# EAGLE design 612_jetracer_328_020024 (EAGLE 9.6.2)
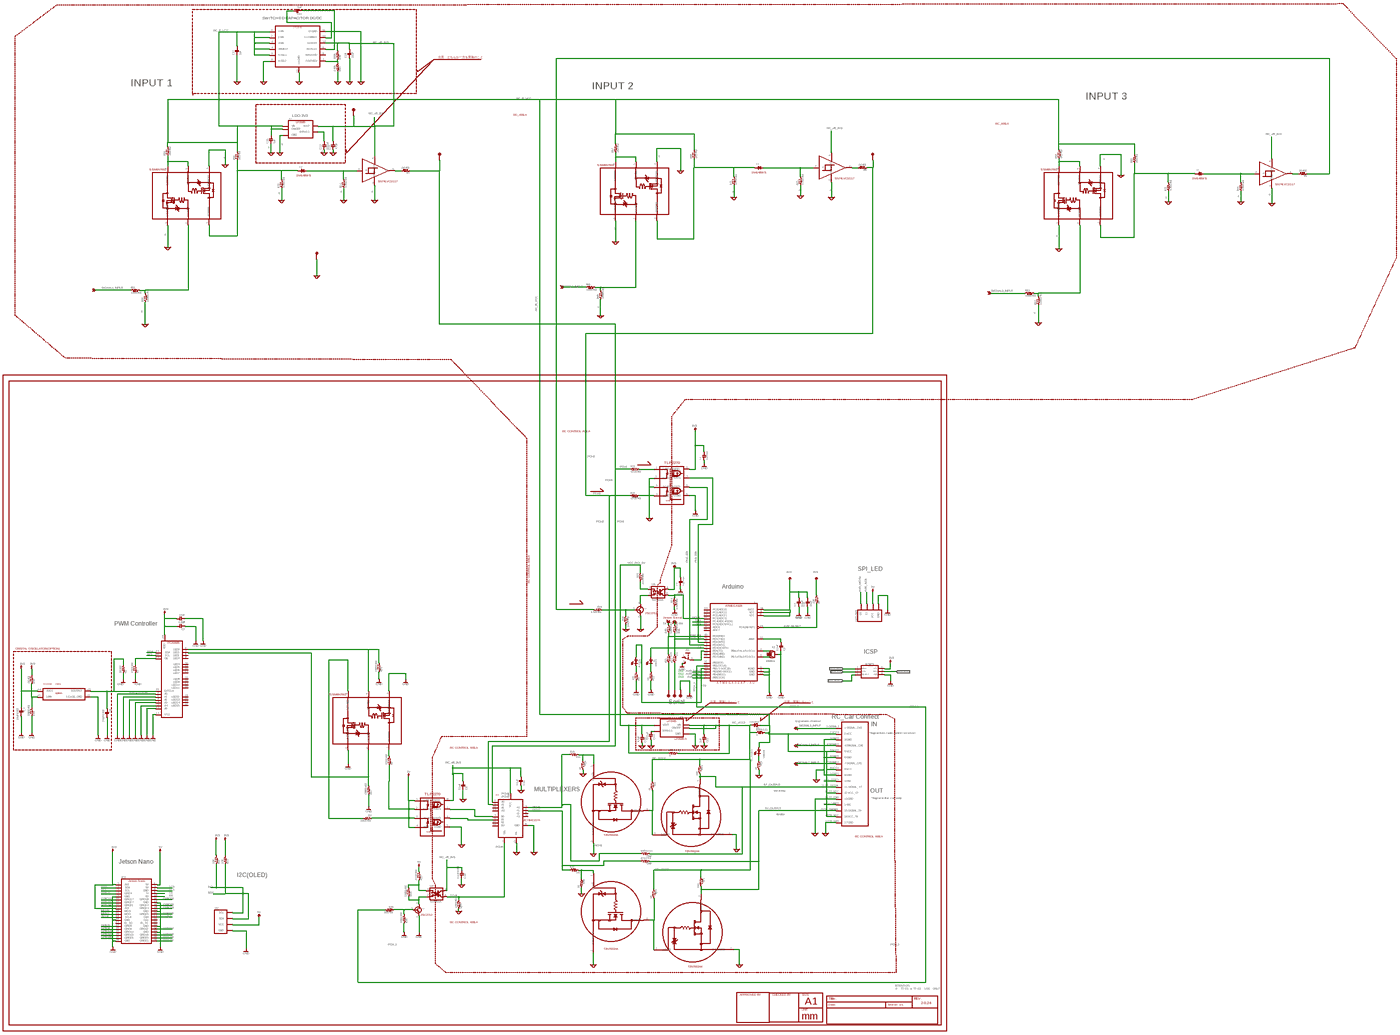
[diagram p0: schematic, sheet 1, overview]
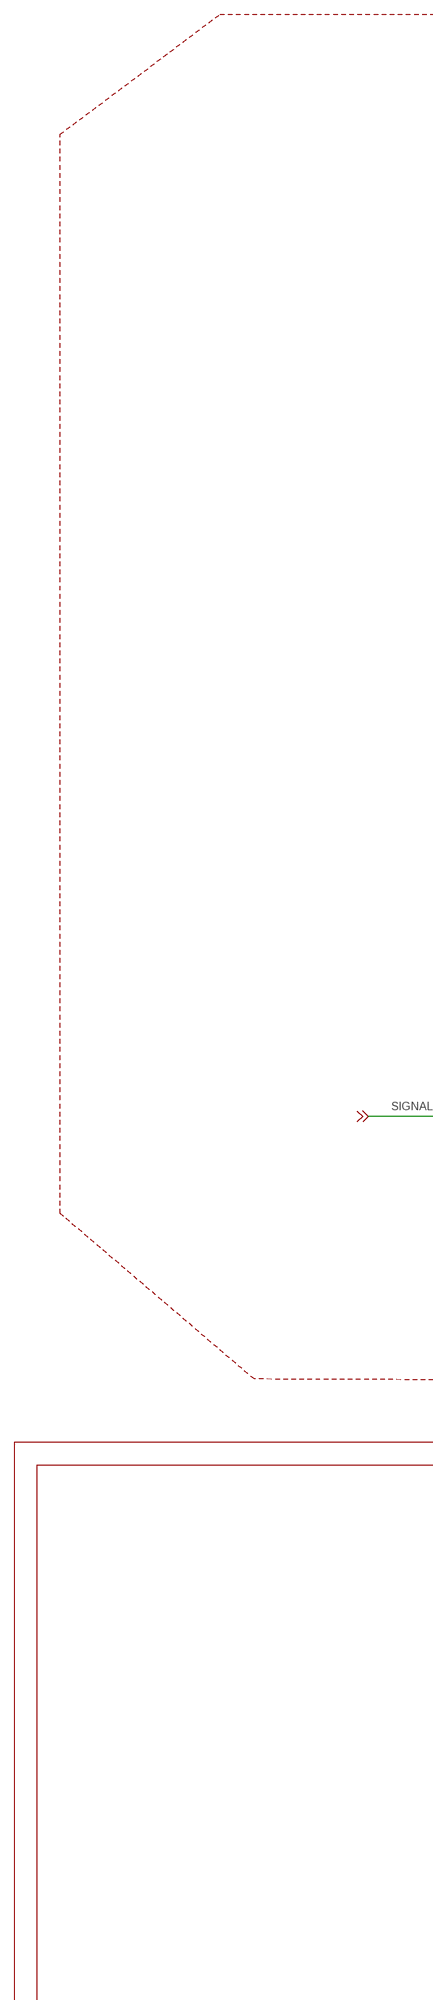
[diagram p1: schematic, sheet 1, part 1 of 7]
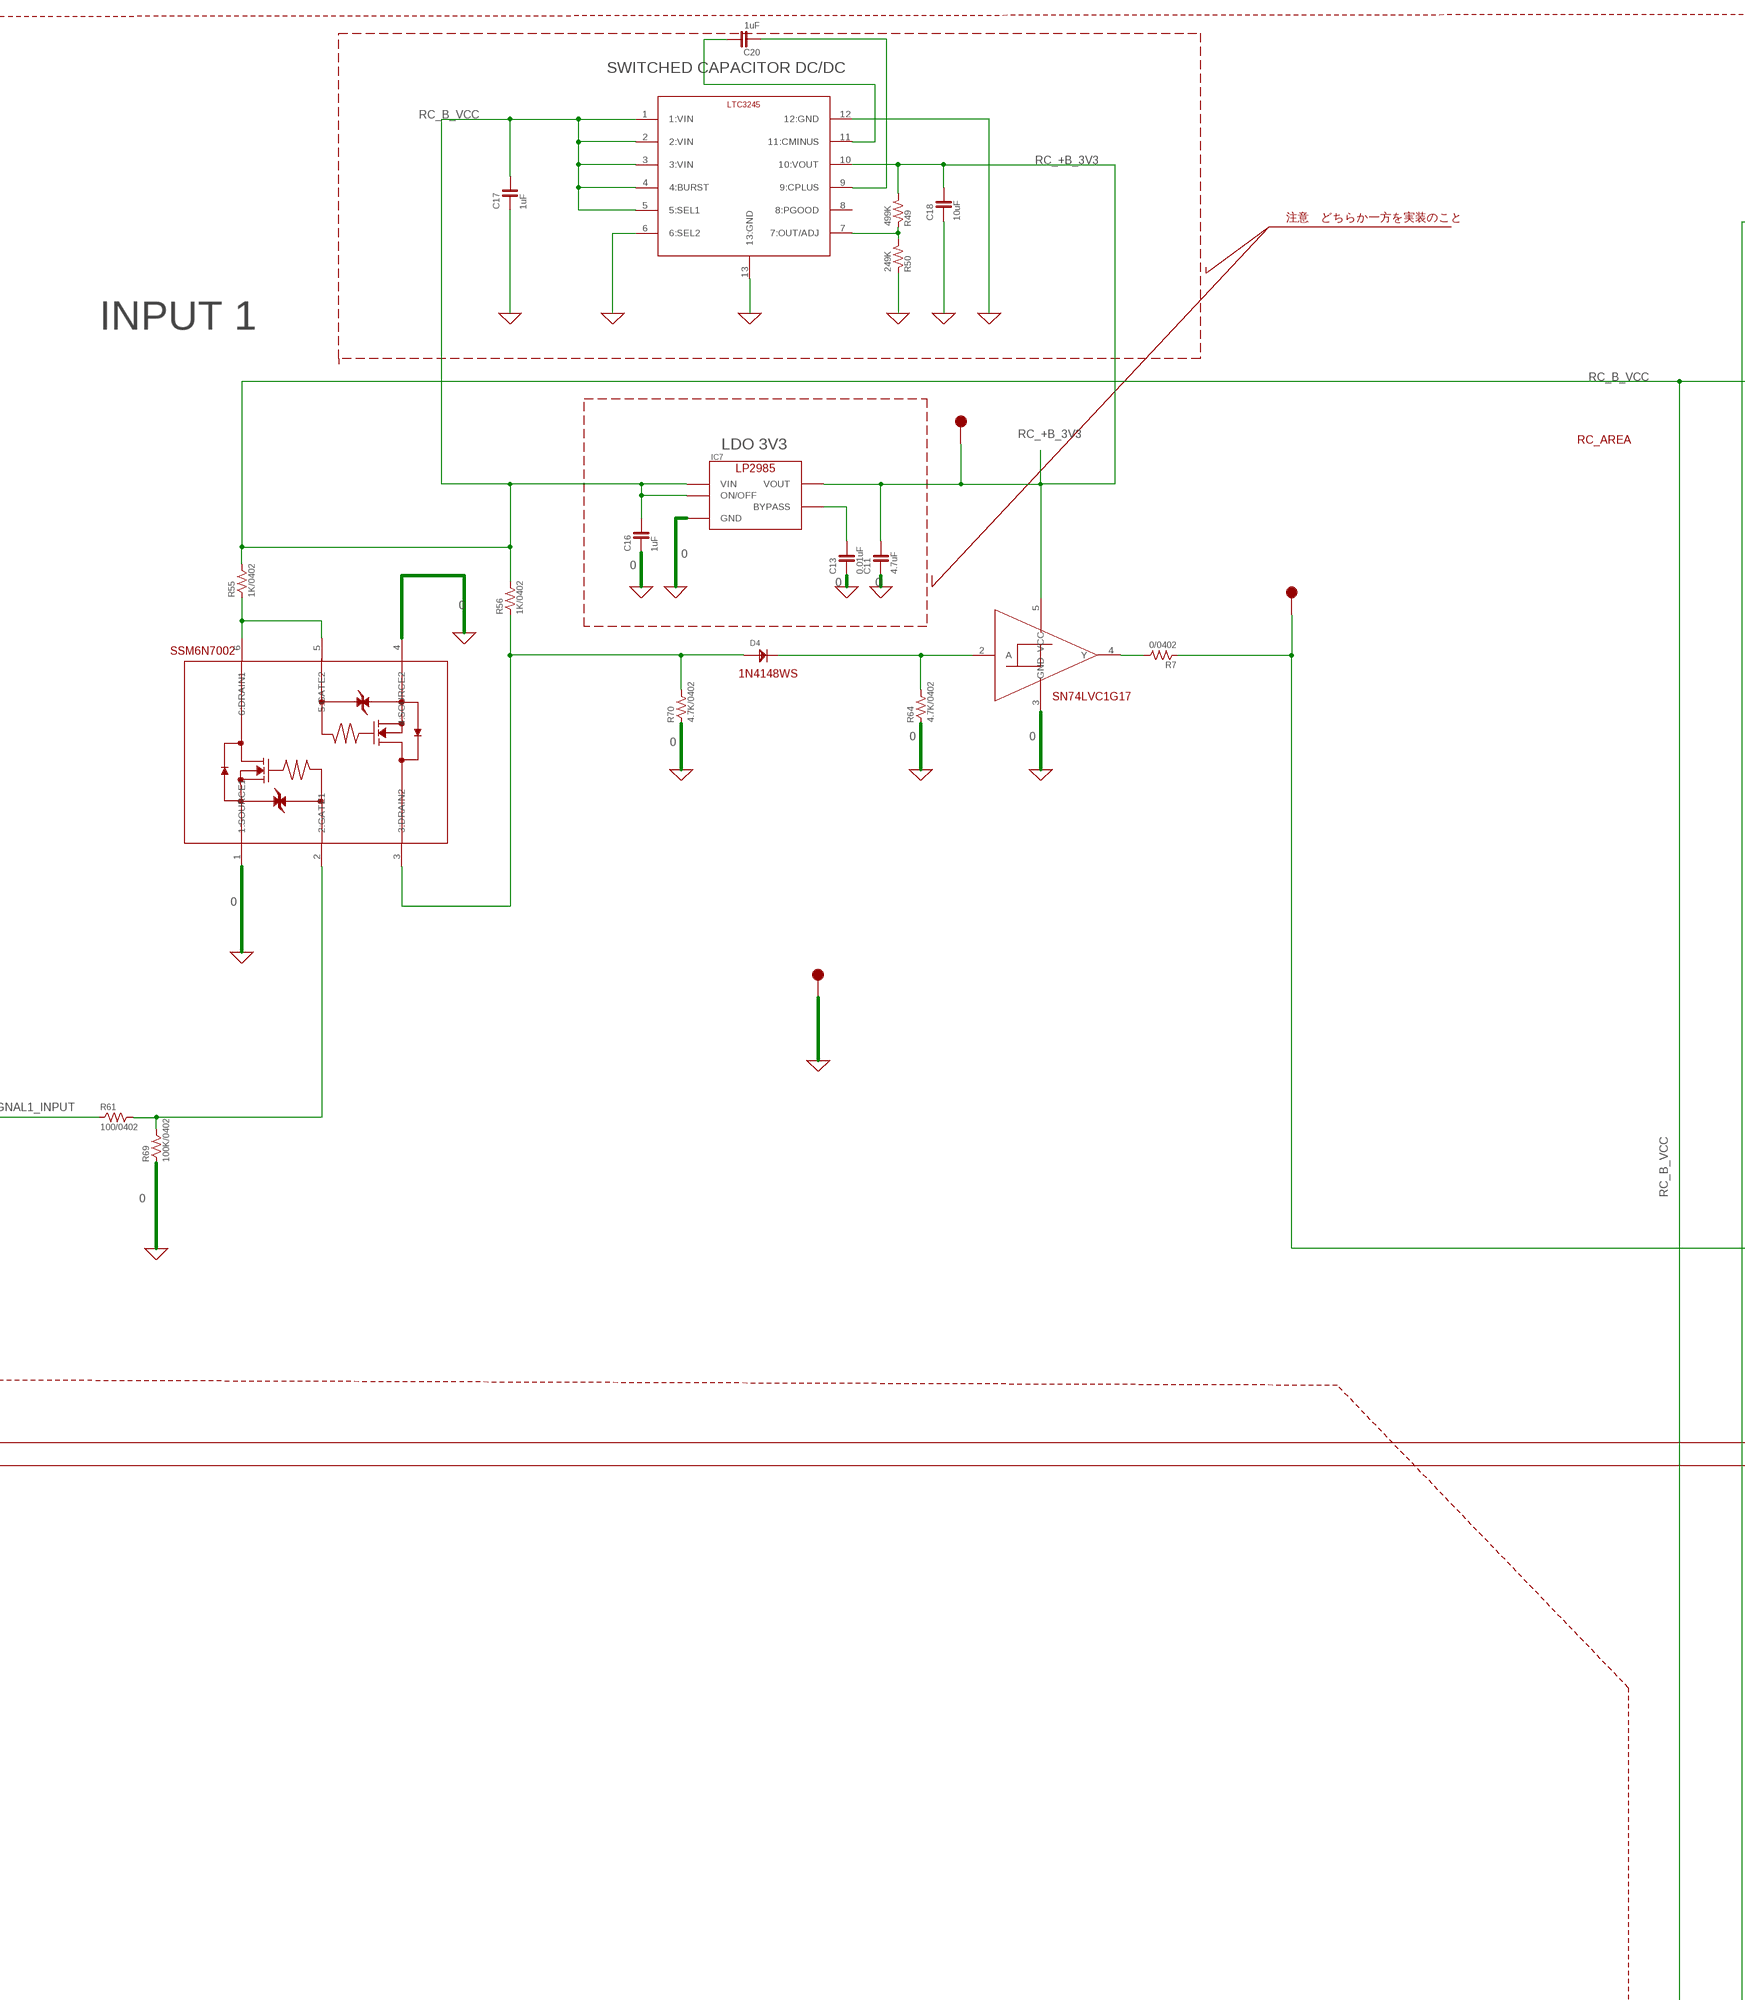
[diagram p2: schematic, sheet 1, part 2 of 7]
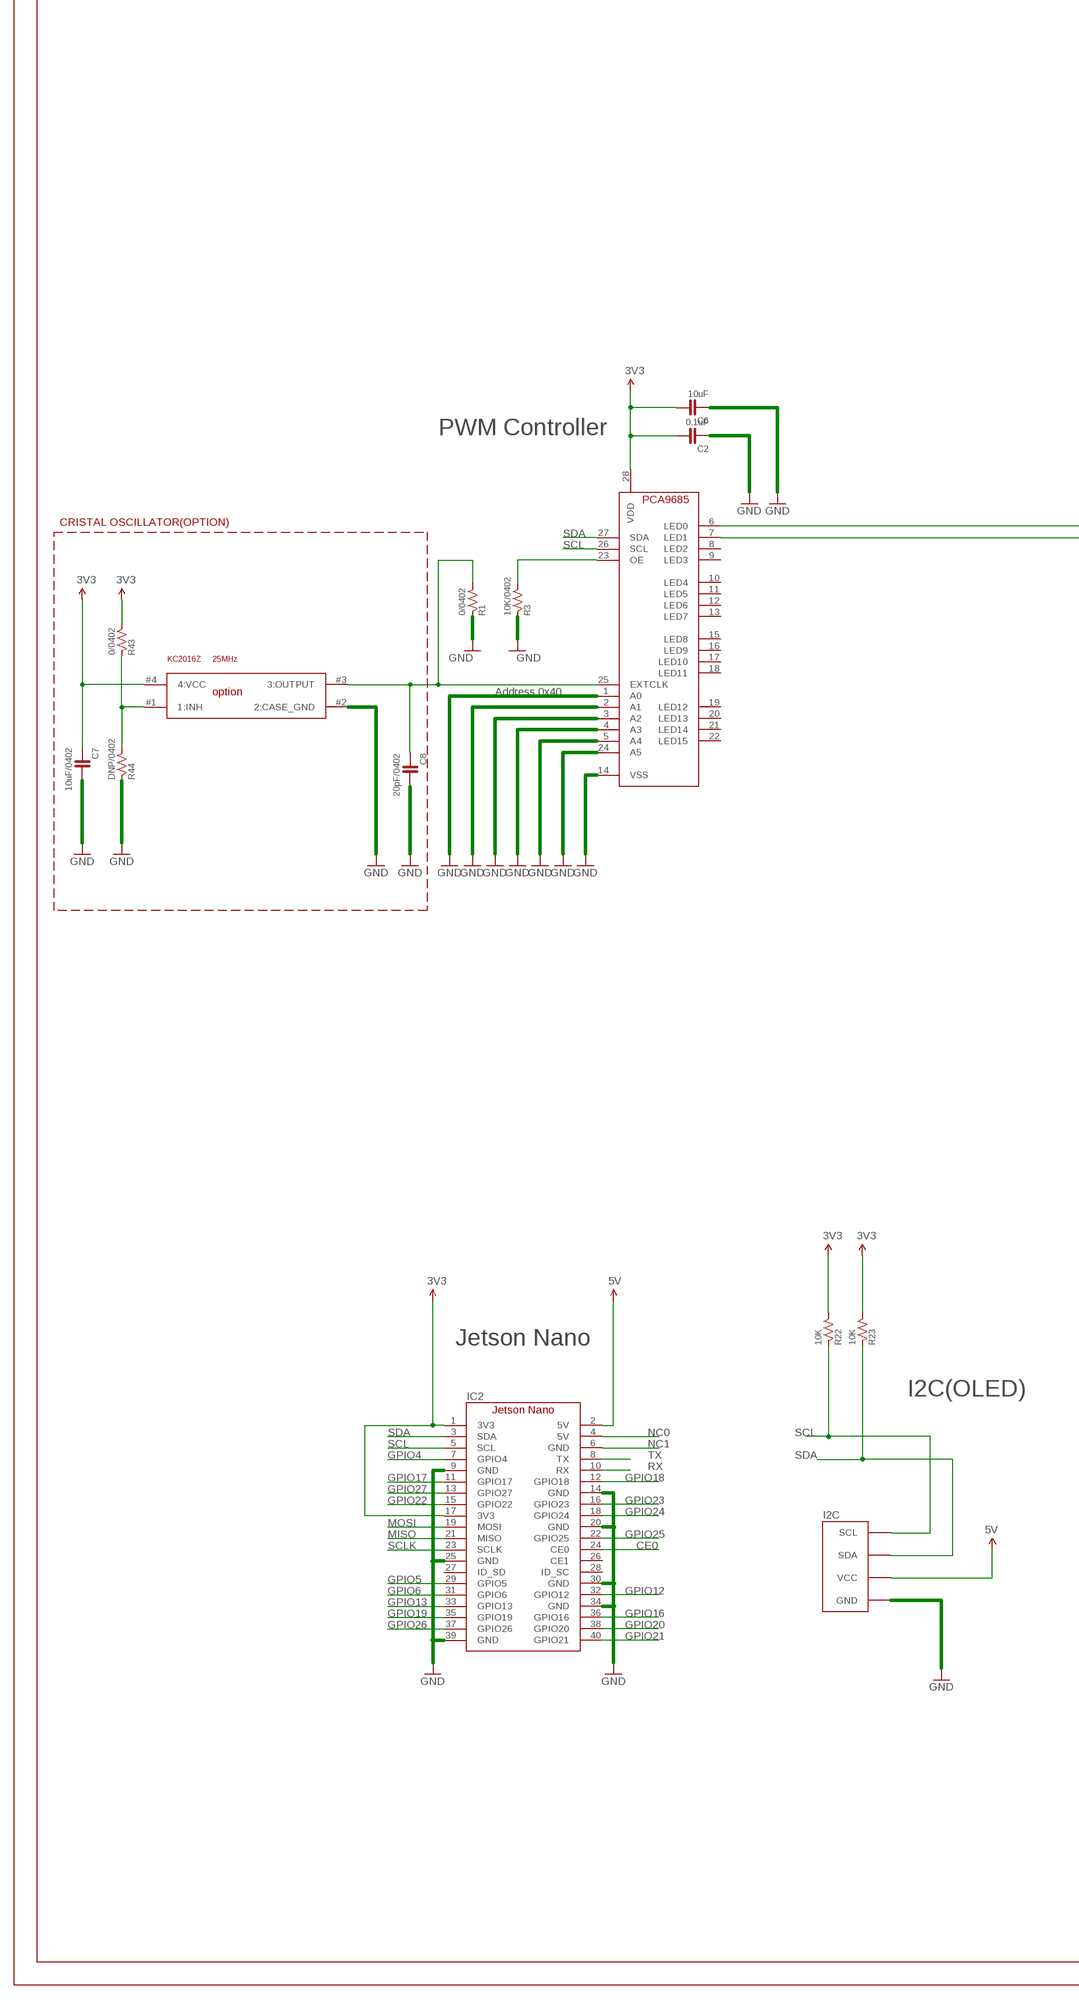
[diagram p3: schematic, sheet 1, part 3 of 7]
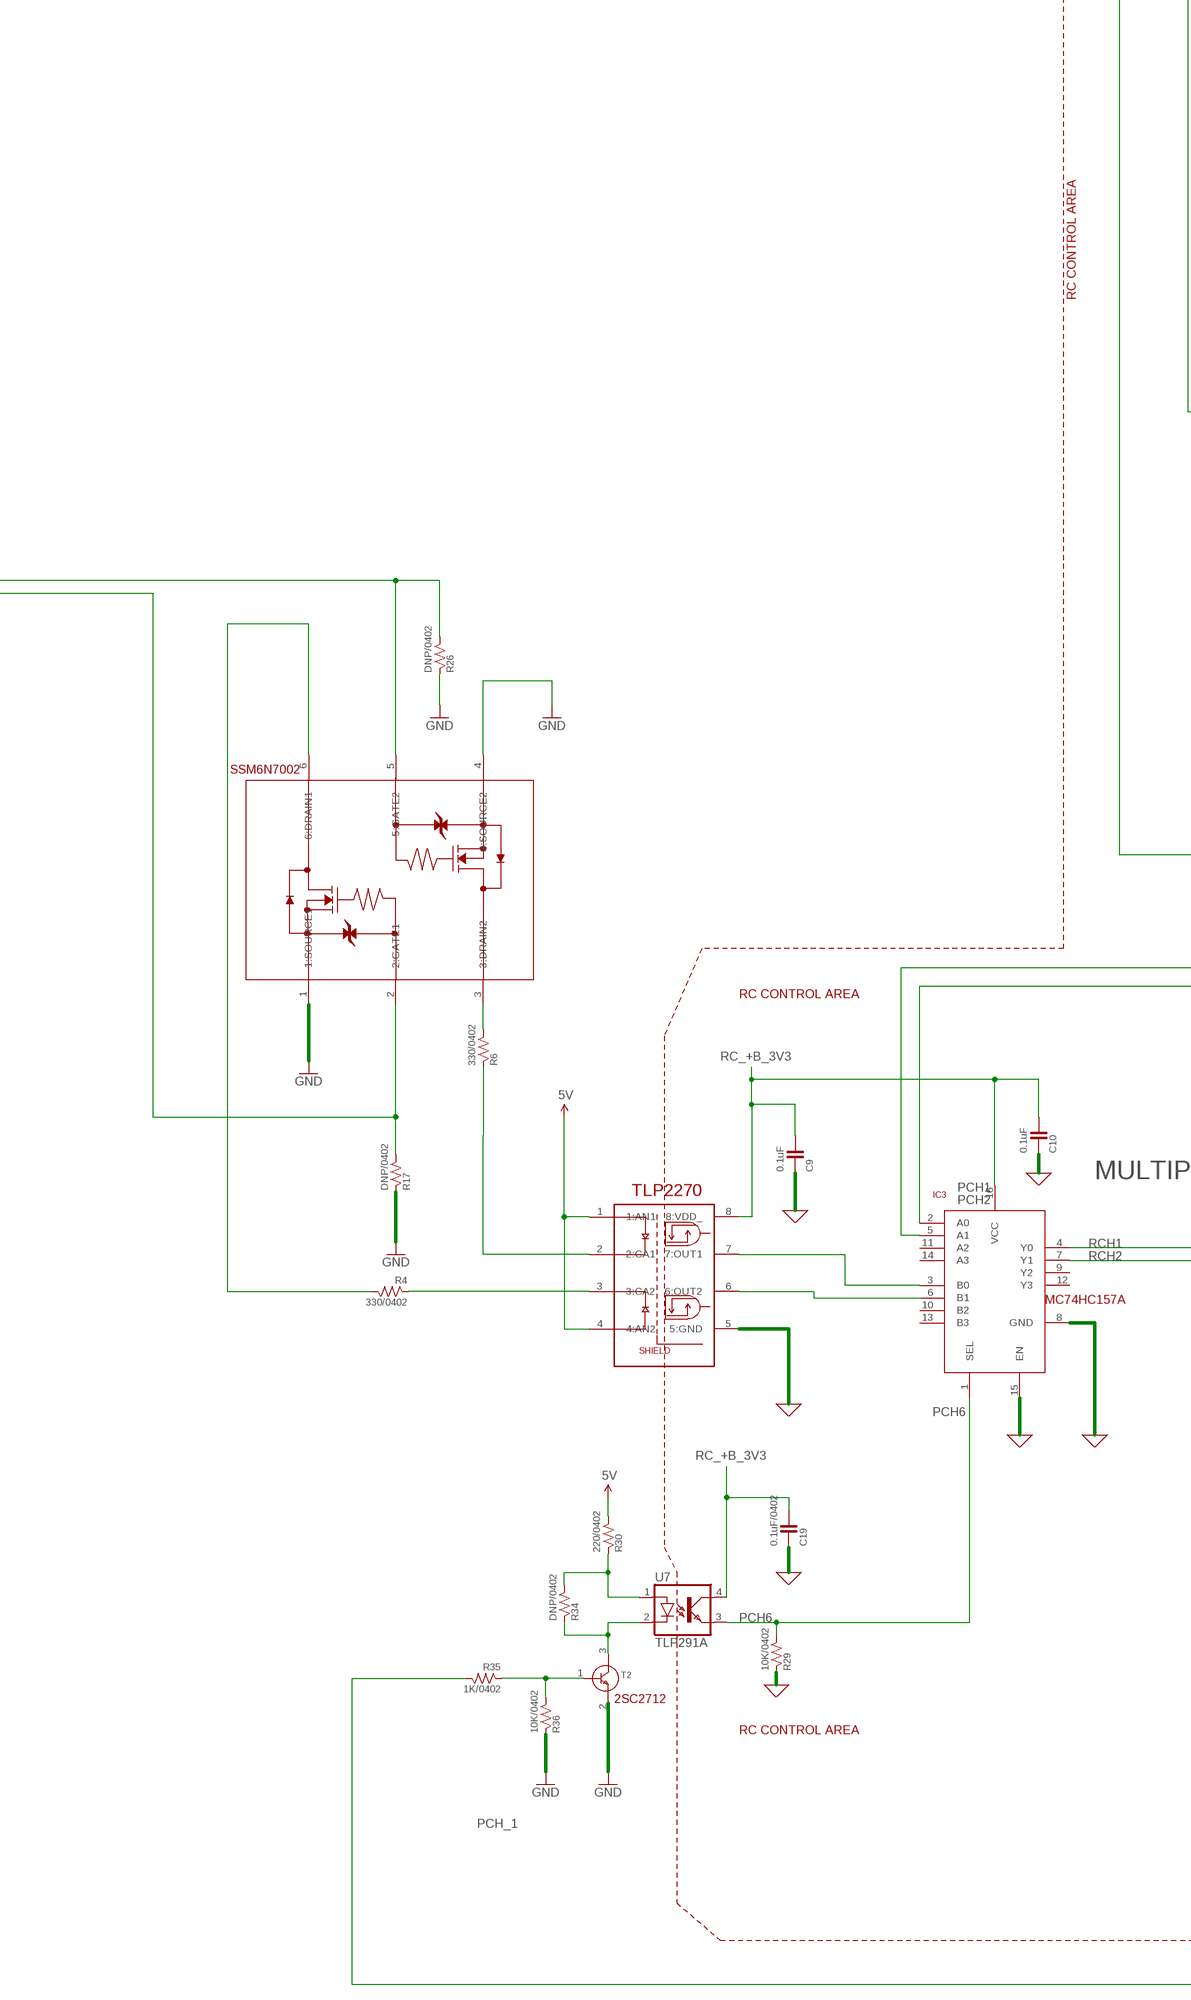
[diagram p4: schematic, sheet 1, part 4 of 7]
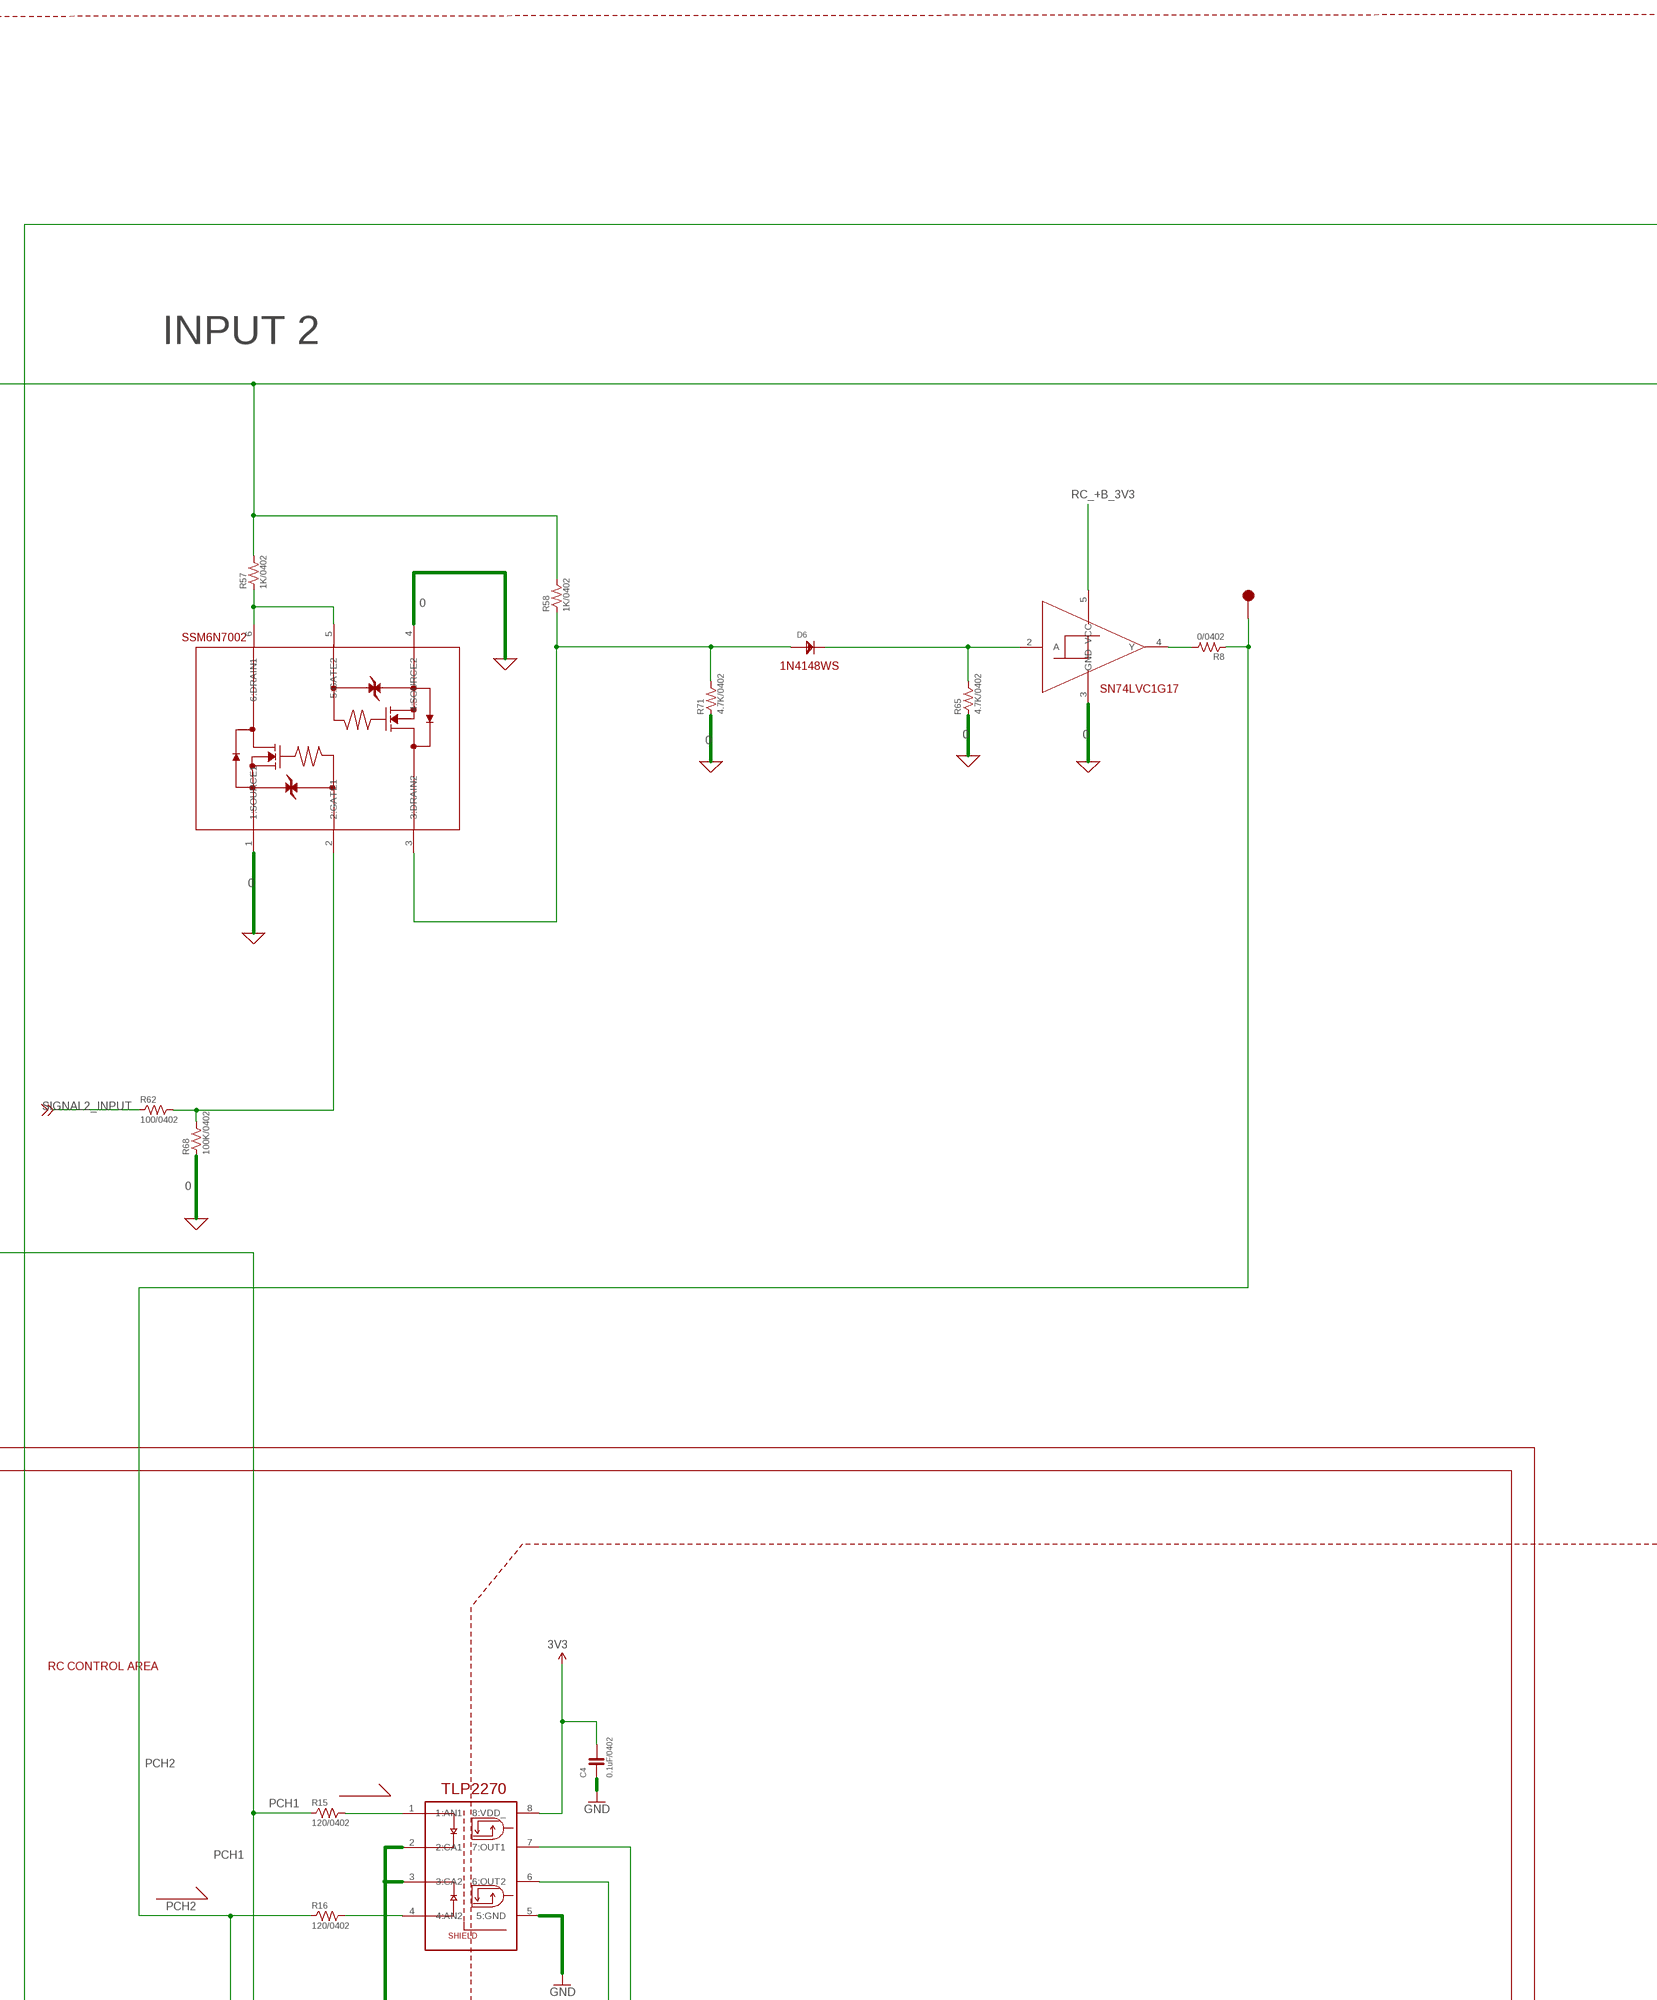
[diagram p5: schematic, sheet 1, part 5 of 7]
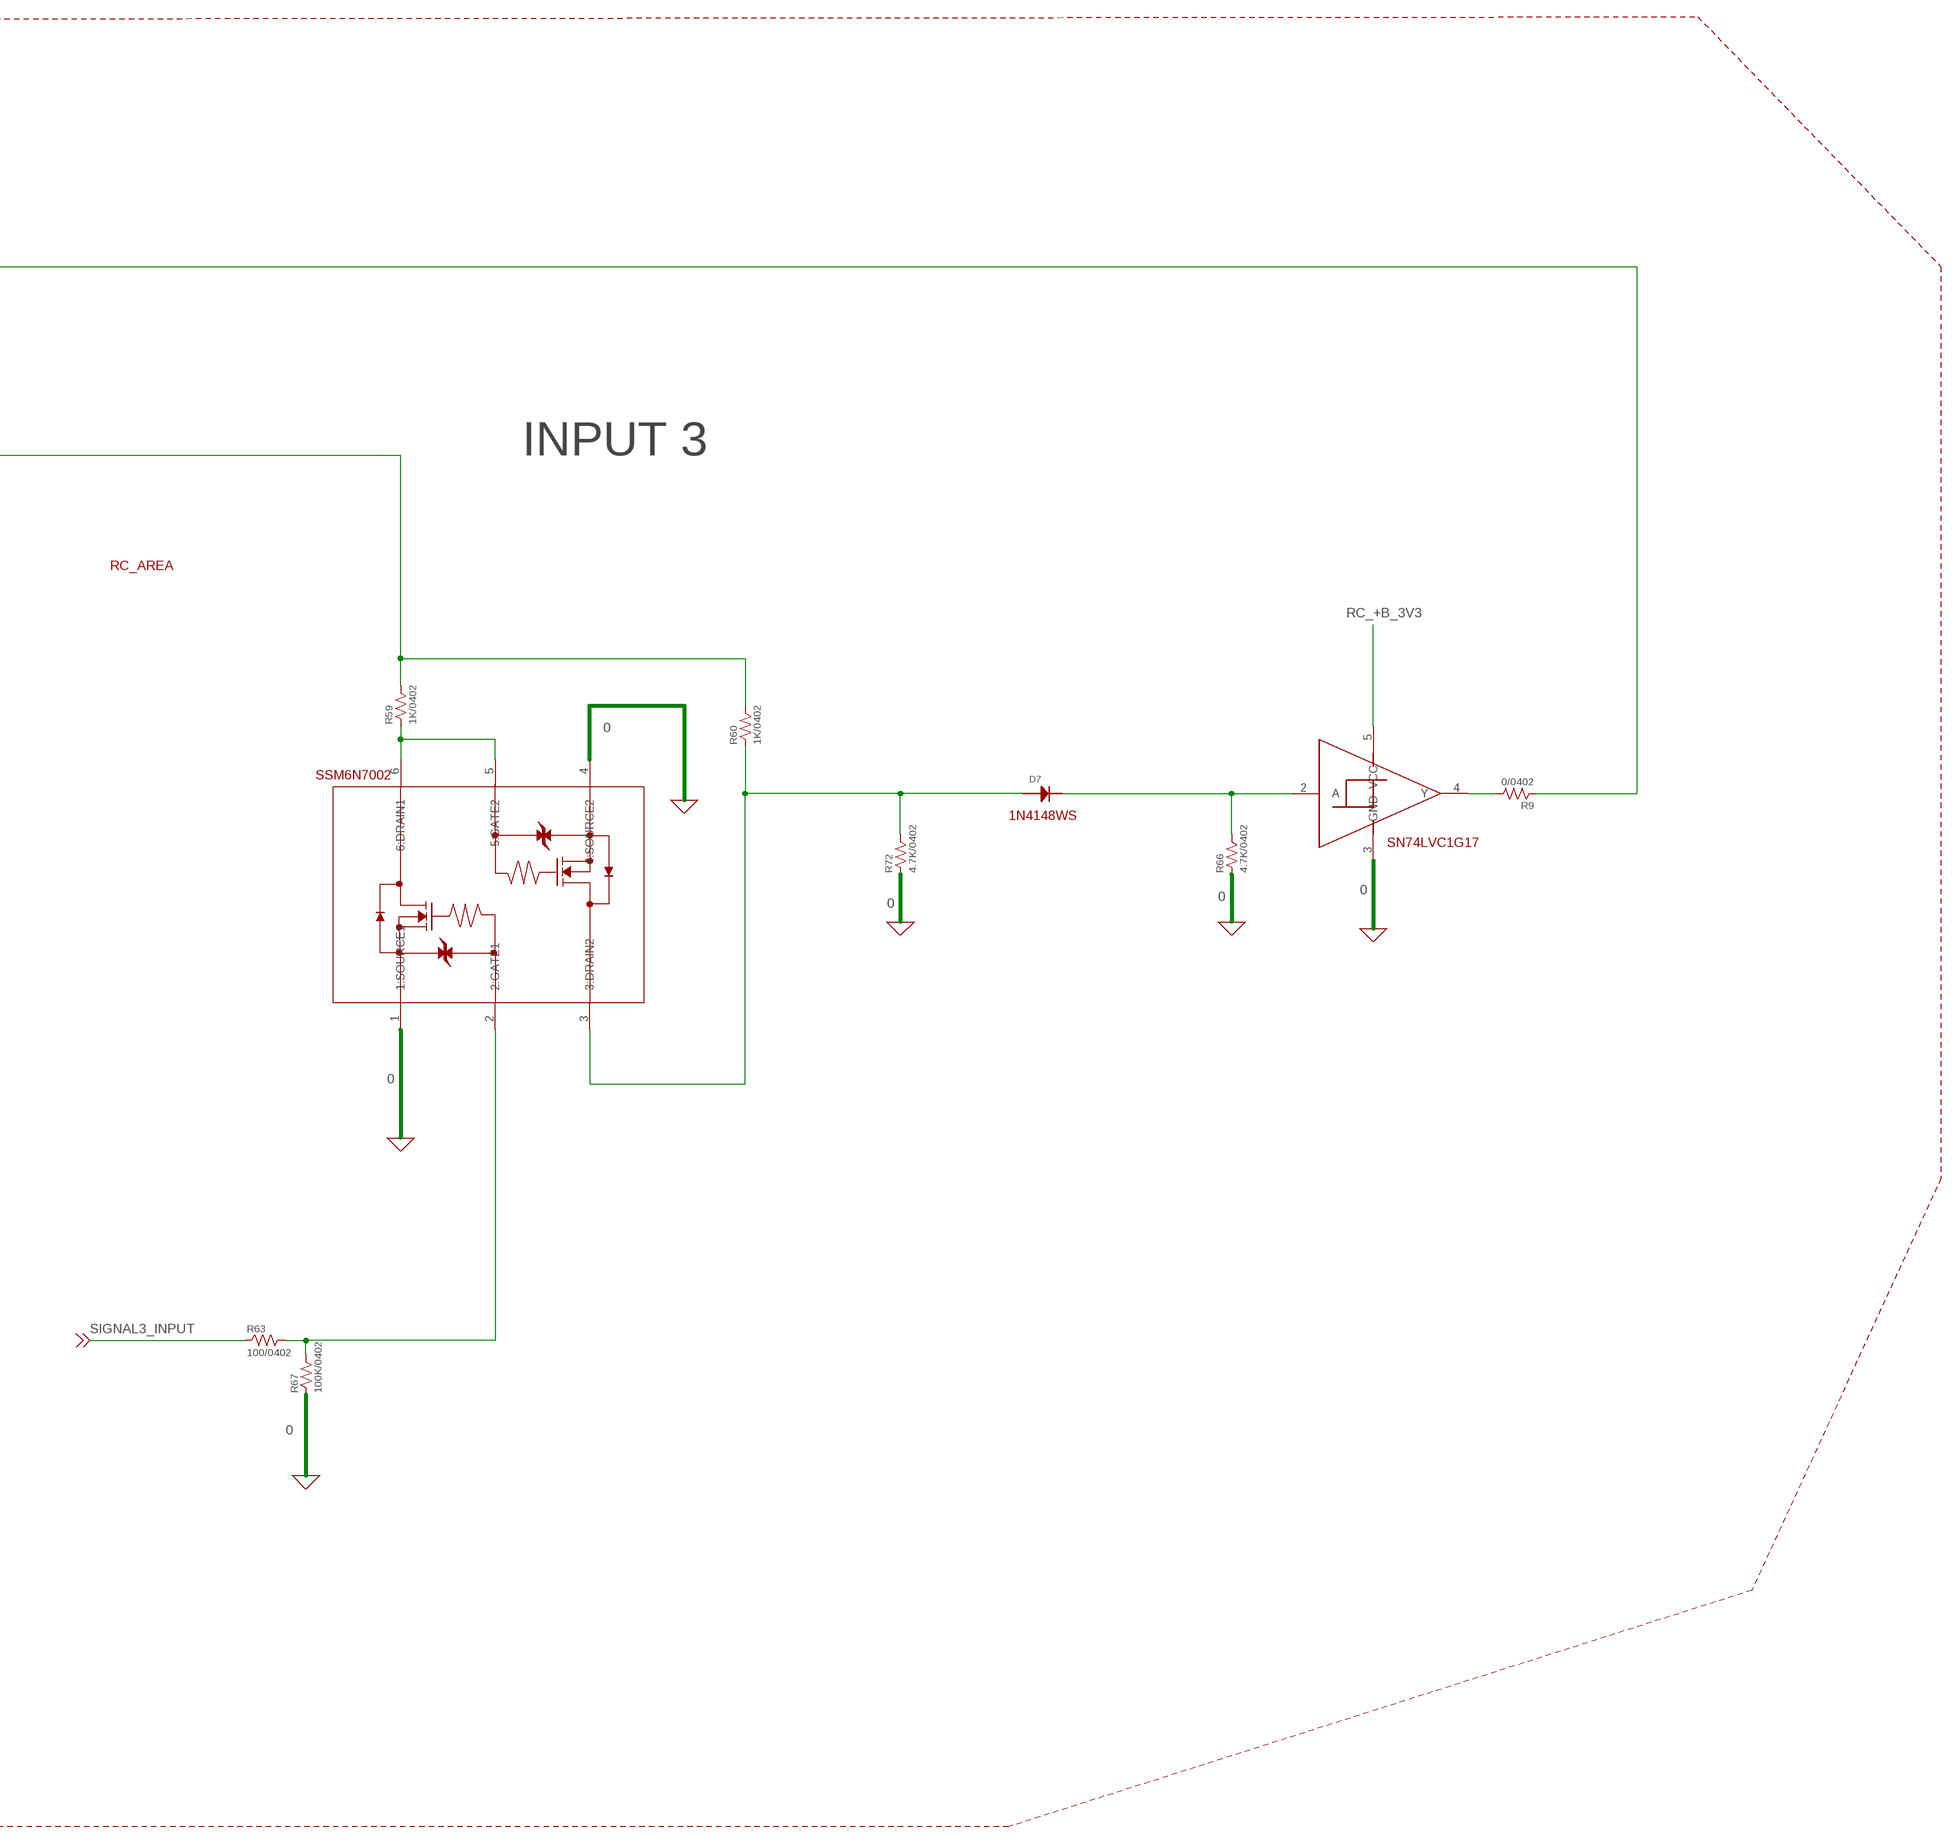
[diagram p6: schematic, sheet 1, part 6 of 7]
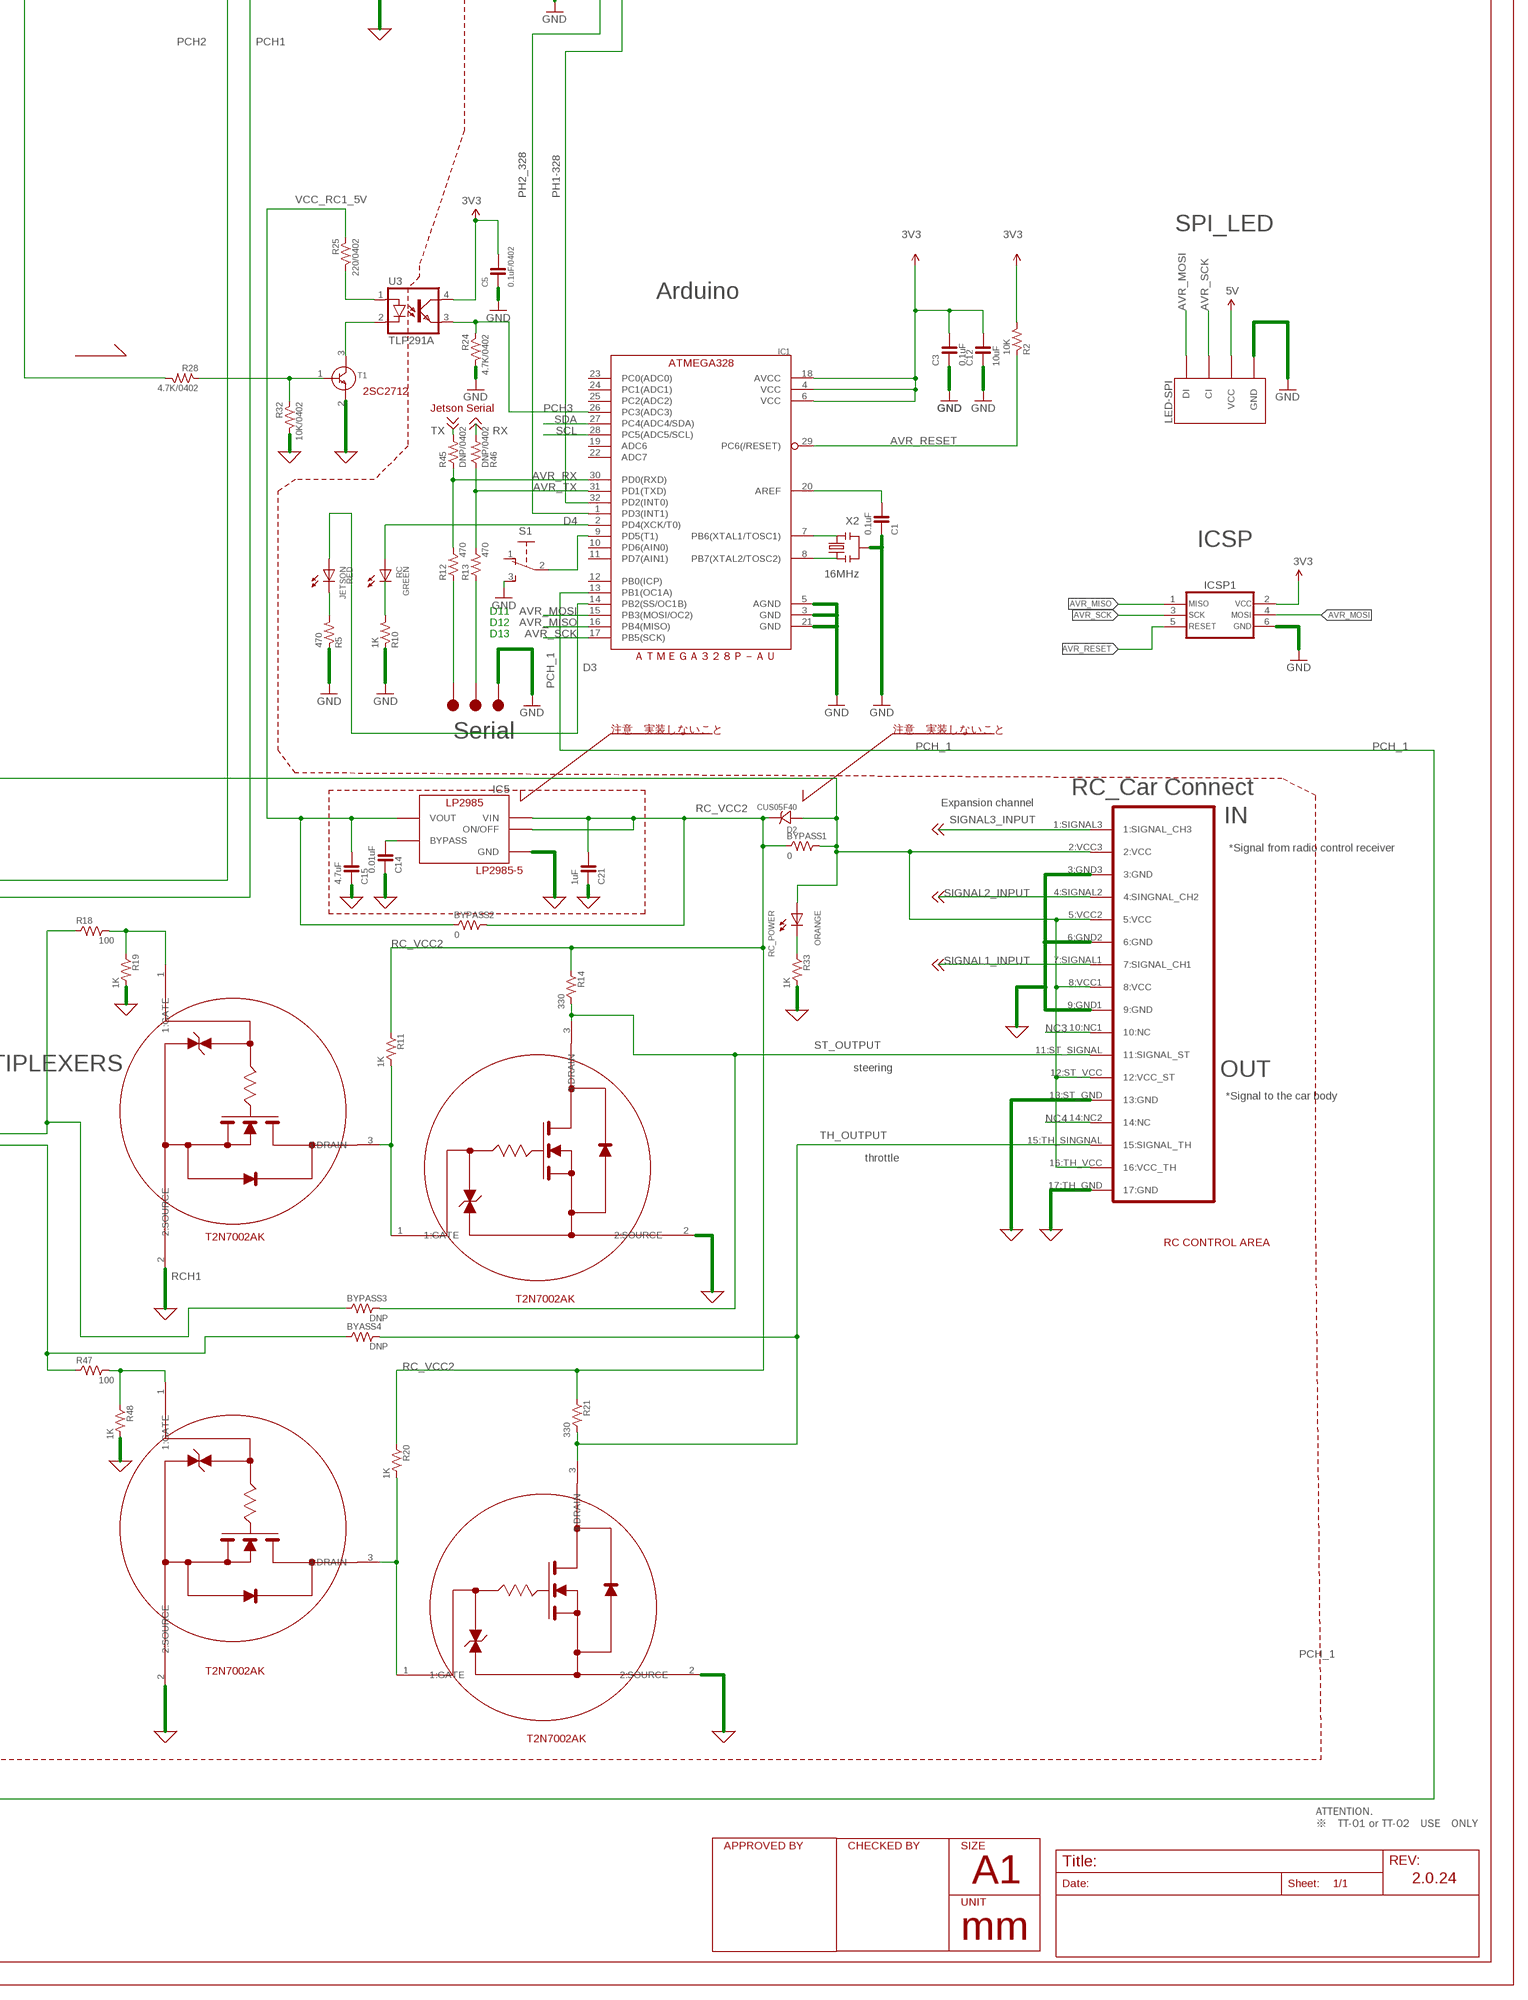
[diagram p7: schematic, sheet 1, part 7 of 7]

## Parts
BYASS4  DNP  RESISTOR-0603  [0603]
BYPASS1  0  RESISTOR-0805  [0805]
BYPASS2  0  RESISTOR-0805  [0805]
BYPASS3  DNP  RESISTOR-0603  [0603]
C1  0.1uF  CAPACITOR-0603  [0603]
C2  0.1uF  CAPACITOR-0603  [0603]
C3  0.1uF  CAPACITOR-0402  [0402]
C4  0.1uF/0402  CAPACITOR-0402  [0402]
C5  0.1uF/0402  CAPACITOR-0402  [0402]
C6  10uF  CAPACITOR-0603  [0603]
C7  10uF/0402  CAPACITOR-0402  [0402]
C8  20pF/0402  CAPACITOR-0402  [0402]
C9  0.1uF  CAPACITOR-0603  [0603]
C10  0.1uF  CAPACITOR-0603  [0603]
C11  4.7uF  CAPACITOR-0603  [0603]
C12  10uF  CAPACITOR-0402  [0402]
C13  0.01uF  CAPACITOR-0603  [0603]
C14  0.01uF  CAPACITOR-0603  [0603]
C15  4.7uF  CAPACITOR-0603  [0603]
C16  1uF  CAPACITOR-0603  [0603]
C17  1uF  CAPACITOR-0603  [0603]
C18  10uF  CAPACITOR-0603  [0603]
C19  0.1uF/0402  CAPACITOR-0402  [0402]
C20  1uF  CAPACITOR-0603  [0603]
C21  1uF  CAPACITOR-0603  [0603]
D2  CUS05F40  [CUS05F40]
D4  DIODE-SOD-323  [SOD-323]
D6  DIODE-SOD-323  [SOD-323]
D7  DIODE-SOD-323  [SOD-323]
I2C  FABO-I2C_BM04B  [I2C-BM04B-PASS-1]
IC1  ATMEGA328P-AU  [TQFP-32]
IC2  JETSON_NANO_NOBORDER  [JETSON_NANO_NOBOARDER]
IC3  MULTIPLEXERSMC74HC157A  [TSSOP-16]
IC4  PCA9685_BOTTOM  [PCA9685_BOTTOM]
IC5  LP2985-33DBV  [SOT-23-5]
IC7  LP2985-33DBV  [SOT-23-5]
ICSP1  ICSP_AVR-TC_NOHOLE  [TC2030]
JETSON  GREEN  LED-0603  [0603]
LED-SPI  FABO-SPI-LED-BM04B  [SPI-BM04B-PASS-1]
R1  0/0402  RESISTOR-0402  [0402]
R2  10K  RESISTOR-0603  [0603]
R3  10K/0402  RESISTOR-0402  [0402]
R4  330/0402  RESISTOR-0402  [0402]
R5  470  RESISTOR-0603  [0603]
R6  330/0402  RESISTOR-0402  [0402]
R7  0/0402  RESISTOR-0402  [0402]
R8  0/0402  RESISTOR-0402  [0402]
R9  0/0402  RESISTOR-0402  [0402]
R10  1K  RESISTOR-0603  [0603]
R11  1K  RESISTOR-0603  [0603]
R12  470  RESISTOR-0603  [0603]
R13  470  RESISTOR-0603  [0603]
R14  330  RESISTOR-0603  [0603]
R15  120/0402  RESISTOR-0402  [0402]
R16  120/0402  RESISTOR-0402  [0402]
R17  DNP/0402  RESISTOR-0402  [0402]
R18  100  RESISTOR-0603  [0603]
R19  1K  RESISTOR-0603  [0603]
R20  1K  RESISTOR-0603  [0603]
R21  330  RESISTOR-0603  [0603]
R22  10K  RESISTOR-0603  [0603]
R23  10K  RESISTOR-0603  [0603]
R24  4.7K/0402  RESISTOR-0402  [0402]
R25  220/0402  RESISTOR-0402  [0402]
R26  DNP/0402  RESISTOR-0402  [0402]
R28  4.7K/0402  RESISTOR-0402  [0402]
R29  10K/0402  RESISTOR-0402  [0402]
R30  220/0402  RESISTOR-0402  [0402]
R32  10K/0402  RESISTOR-0402  [0402]
R33  1K  RESISTOR-0603  [0603]
R34  DNP/0402  RESISTOR-0402  [0402]
R35  1K/0402  RESISTOR-0402  [0402]
R36  10K/0402  RESISTOR-0402  [0402]
R43  0/0402  RESISTOR-0402  [0402]
R44  DNP/0402  RESISTOR-0402  [0402]
R45  DNP/0402  RESISTOR-0402  [0402]
R46  DNP/0402  RESISTOR-0402  [0402]
R47  100  RESISTOR-0603  [0603]
R48  1K  RESISTOR-0603  [0603]
R49  499K  RESISTOR-0603  [0603]
R50  249K  RESISTOR-0603  [0603]
R55  1K/0402  RESISTOR-0402  [0402]
R56  1K/0402  RESISTOR-0402  [0402]
R57  1K/0402  RESISTOR-0402  [0402]
R58  1K/0402  RESISTOR-0402  [0402]
R59  1K/0402  RESISTOR-0402  [0402]
R60  1K/0402  RESISTOR-0402  [0402]
R61  100/0402  RESISTOR-0402  [0402]
R62  100/0402  RESISTOR-0402  [0402]
R63  100/0402  RESISTOR-0402  [0402]
R64  4.7K/0402  RESISTOR-0402  [0402]
R65  4.7K/0402  RESISTOR-0402  [0402]
R66  4.7K/0402  RESISTOR-0402  [0402]
R67  100K/0402  RESISTOR-0402  [0402]
R68  100K/0402  RESISTOR-0402  [0402]
R69  100K/0402  RESISTOR-0402  [0402]
R70  4.7K/0402  RESISTOR-0402  [0402]
R71  4.7K/0402  RESISTOR-0402  [0402]
R72  4.7K/0402  RESISTOR-0402  [0402]
RC  RED  LED-0603  [0603]
RC_POWER  ORANGE  LED-0603  [0603]
S1  SLIDE-SSSS810701  [SSSS810701]
T1  TRANSISTOR-NPN  [SOT-23]
T2  TRANSISTOR-NPN  [SOT-23]
T3  T2N7002AK  [SOT-23]
T4  T2N7002AK  [SOT-23]
T10  T2N7002AK  [SOT-23]
T11  T2N7002AK  [SOT-23]
TP1  TP-15  [TP-15]
TP2  TP-15  [TP-15]
TP3  TP-15  [TP-15]
TP4  TP-15  [TP-15]
TP5  TP-15  [TP-15]
TP6  TP-15  [TP-15]
TP7  TP-15  [TP-15]
U3  TLP291A  [11-3C1]
U5  TLP2270  [TLP2270]
U7  TLP291A  [11-3C1]
U12  SSM6N7002KFU  [US6]
U20  SN74LVC1G17  [SOT-23]
U21  SSM6N7002KFU  [US6]
U23  SN74LVC1G17  [SOT-23]
U$1  RC_17PIN_OUTIN  [PNHEADER_2.54_SMT_17PIN_RC_TT01_02]
U$6  SSM6N7002KFU  [US6]
U$7  SN74LVC1G17  [SOT-23]
U$8  TLP2270  [TLP2270]
U$10  SSM6N7002KFU  [US6]
U$11  KC2016Z  [KC2016Z]
U$15  LTC3245  [MSOP12]
X2  16MHz  RESONATOR  [CSTNE_V_C]

## Nets
0: C9.1 C10.1 C11.1 C13.1 C14.1 C15.1 C16.1 C17.1 C18.1 C19.1 C21.1 IC3.8(GND) IC3.15(EN) IC5.2(GND) IC7.2(GND) R19.2 R29.1 R32.2 R33.2 R48.2 R50.1 R64.1 R65.1 R66.1 R67.1 R68.1 R69.1 R70.1 R71.1 R72.1 T1.2(E) T3.2(2:SOURCE) T4.2(2:SOURCE) T10.2(2:SOURCE) T11.2(2:SOURCE) TP7.1 U5.2(2:CA1) U5.3(3:CA2) U12.1(1:SOURCE1) U12.4(4:SOURCE2) U20.3(GND) U21.1(1:SOURCE1) U21.4(4:SOURCE2) U23.3(GND) U$1.3:GND3(3:GND) U$1.6:GND2(6:GND) U$1.9:GND1(9:GND) U$1.13:ST_GND(13:GND) U$1.17:TH_GND(17:GND) U$7.3(GND) U$8.5(5:GND) U$10.1(1:SOURCE1) U$10.4(4:SOURCE2) U$15.6(6:SEL2) U$15.12(12:GND) U$15.13(13:GND) ; supply symbol labelled GND
3V3: C2.2 C3.2 C4.2 C5.2 C6.2 C7.1 C12.2 IC1.4(VCC) IC1.6(VCC) IC1.18(AVCC) IC2.1(3V3) IC2.17(3V3) IC4.28(VDD) ICSP1.2 R2.2 R22.2 R23.2 R43.2 U3.4(COL) U5.8(8:VDD_) U$11.#4(4:VCC)
5V: I2C.5V(VCC) IC2.2(5V) LED-SPI.5V(VCC) R30.2 U$8.1(1:AN1) U$8.4(4:AN2)
AVR_MISO: IC1.16(PB4(MISO)) ICSP1.1
AVR_MOSI: IC1.15(PB3(MOSI/OC2)) ICSP1.4 LED-SPI.DI
AVR_RESET: IC1.29(PC6(/RESET)) ICSP1.5 R2.1
AVR_RX: IC1.30(PD0(RXD)) R12.2 R45.1
AVR_SCK: IC1.17(PB5(SCK)) ICSP1.3 LED-SPI.CI
AVR_TX: IC1.31(PD1(TXD)) R13.2 R46.1
CE0: IC2.24(CE0)
D3: IC1.14(PB2(SS/OC1B)) RC.ANODE
D4: IC1.2(PD4(XCK/T0)) JETSON.ANODE
GND: C1.1 C2.1 C3.1 C4.1 C5.1 C6.1 C7.2 C8.2 C12.1 I2C.GND IC1.3(GND) IC1.5(AGND) IC1.21(GND) IC2.9(GND) IC2.14(GND) IC2.20(GND) IC2.25(GND) IC2.30(GND) IC2.34(GND) IC2.39(GND) IC4.1(A0) IC4.2(A1) IC4.3(A2) IC4.4(A3) IC4.5(A4) IC4.14(VSS) IC4.24(A5) ICSP1.6 LED-SPI.GND R1.1 R3.1 R5.1 R10.1 R17.1 R24.2 R26.1 R36.1 R44.1 S1.3 T2.2(E) TP3.1 U5.5(5:GND) U$6.1(1:SOURCE1) U$6.4(4:SOURCE2) U$11.#2(2:CASE_GND) X2.2
GPIO4: IC2.7(GPIO4)
GPIO5: IC2.29(GPIO5)
GPIO6: IC2.31(GPIO6)
GPIO12: IC2.32(GPIO12)
GPIO13: IC2.33(GPIO13)
GPIO16: IC2.36(GPIO16)
GPIO17: IC2.11(GPIO17)
GPIO18: IC2.12(GPIO18)
GPIO19: IC2.35(GPIO19)
GPIO20: IC2.38(GPIO20)
GPIO21: IC2.40(GPIO21)
GPIO22: IC2.15(GPIO22)
GPIO23: IC2.16(GPIO23)
GPIO24: IC2.18(GPIO24)
GPIO25: IC2.22(GPIO25)
GPIO26: IC2.37(GPIO26)
GPIO27: IC2.13(GPIO27)
M: C20.2 U$15.11(11:CMINUS)
MISO: IC2.21(MISO)
MOSI: IC2.19(MOSI)
N$2: IC4.7(LED1) R17.2 U$6.2(2:GATE1)
N$4: C1.2 IC1.20(AREF)
N$5: IC1.8(PB7(XTAL2/TOSC2)) X2.3
N$6: R12.1 TP1.1
N$7: IC4.23(OE) R3.2
N$8: C8.1 IC4.25(EXTCLK) R1.2 U$11.#3(3:OUTPUT)
N$9: R16.2 U5.4(4:AN2)
N$10: R15.2 U5.1(1:AN1)
N$11: R9.1 R28.2
N$12: R7.2 U$7.4(Y)
N$13: IC4.6(LED0) R26.2 U$6.5(5:GATE2)
N$14: IC3.6(B1) U$8.6(6:OUT2)
N$15: IC1.7(PB6(XTAL1/TOSC1)) X2.1
N$16: IC1.9(PD5(T1)) S1.2
N$17: R13.1 TP2.1
N$18: R11.2 T3.1(1:GATE) T10.3(3:DRAIN)
N$19: R5.2 RC.CATHODE
N$20: JETSON.CATHODE R10.2
N$21: R4.2 U$6.6(6:DRAIN1)
N$22: R6.2 U$6.3(3:DRAIN2)
N$23: R6.1 U$8.2(2:CA1)
N$24: R4.1 U$8.3(3:CA2)
N$25: R25.2 U3.1(A)
N$26: T1.3(C) U3.2(C)
N$27: R28.1 R32.1 T1.1(B)
N$28: R33.1 RC_POWER.CATHODE
N$29: R35.1 R36.2 T2.1(B)
N$30: R34.1 T2.3(C) U7.2(C)
N$31: C14.2 IC5.4(BYPASS)
N$33: R30.1 R34.2 U7.1(A)
N$34: R47.2 R48.1 T11.1(1:GATE)
N$35: R18.2 R19.1 T10.1(1:GATE)
N$36: R20.2 T4.1(1:GATE) T11.3(3:DRAIN)
N$37: IC3.3(B0) U$8.7(7:OUT1)
N$39: R49.1 R50.2 U$15.7(7:OUT/ADJ)
N$49: R43.1 R44.2 U$11.#1(1:INH)
N$54: D4.A(ANODE) R56.1 R70.2 U$10.3(3:DRAIN2)
N$55: D4.K(CATHODE) R64.2 U$7.2(A)
N$57: D6.A(ANODE) R58.1 R71.2 U12.3(3:DRAIN2)
N$58: D6.K(CATHODE) R65.2 U20.2(A)
N$59: R8.2 U20.4(Y)
N$60: D7.A(ANODE) R60.1 R72.2 U21.3(3:DRAIN2)
N$62: D7.K(CATHODE) R66.2 U23.2(A)
N$63: R9.2 U23.4(Y)
N$64: R61.2 R69.2 U$10.2(2:GATE1)
N$68: R63.2 R67.2 U21.2(2:GATE1)
N$69: C13.2 IC7.4(BYPASS)
N$72: R55.1 U$10.5(5:GATE2) U$10.6(6:DRAIN1)
N$73: R62.2 R68.2 U12.2(2:GATE1)
N$74: R57.1 U12.5(5:GATE2) U12.6(6:DRAIN1)
N$75: R59.1 U21.5(5:GATE2) U21.6(6:DRAIN1)
NC0: IC2.4(5V)
NC1: IC2.6(GND)
NC3: U$1.10:NC1(10:NC)
NC4: U$1.14:NC2(14:NC)
P: C20.1 U$15.9(9:CPLUS)
PCH1: IC3.2(A0) R7.1 R15.1 TP5.1
PCH2: IC3.5(A1) R8.1 R16.1 TP6.1
PCH3: IC1.26(PC3(ADC3)) R24.1 U3.3(EMI)
PCH6: IC3.1(SEL) R29.2 U7.3(EMI)
PCH_1: IC1.13(PB1(OC1A)) R35.2
PH1-328: IC1.32(PD2(INT0)) U5.7(7:OUT1)
PH2_328: IC1.1(PD3(INT1)) U5.6(6:OUT2)
RC_+B_3V3: C9.2 C10.2 C11.2 C18.2 C19.2 IC3.16(VCC) IC7.5(VOUT) R49.2 TP4.1 U7.4(COL) U20.5(VCC) U23.5(VCC) U$7.5(VCC) U$8.8(8:VDD_) U$15.10(10:VOUT)
RC_B_VCC: BYPASS1.2 C16.2 C17.2 D2.A(ANODE) IC7.1(VIN) IC7.3(ON/OFF) R55.2 R56.2 R57.2 R58.2 R59.2 R60.2 RC_POWER.ANODE U$1.2:VCC3(2:VCC) U$1.5:VCC2(5:VCC) U$1.8:VCC1(8:VCC) U$1.12:ST_VCC(12:VCC_ST) U$1.16:TH_VCC(16:VCC_TH) U$15.1(1:VIN) U$15.2(2:VIN) U$15.3(3:VIN) U$15.4(4:BURST) U$15.5(5:SEL1)
RC_VCC2: BYPASS1.1 BYPASS2.2 C21.2 D2.C(CATHODE) IC5.1(VIN) IC5.3(ON/OFF) R11.1 R14.1 R20.1 R21.1
RCH1: BYPASS3.1 IC3.4(Y0) R18.1
RCH2: BYASS4.1 IC3.7(Y1) R47.1
RX: IC2.10(RX) R46.2
SCL: I2C.SCL IC1.28(PC5(ADC5/SCL)) IC2.5(SCL) IC4.26(SCL) R22.1
SCLK: IC2.23(SCLK)
SDA: I2C.SDA IC1.27(PC4(ADC4/SDA)) IC2.3(SDA) IC4.27(SDA) R23.1
SIGNAL1_INPUT: R61.1 U$1.7:SIGNAL1(7:SIGNAL_CH1)
SIGNAL2_INPUT: R62.1 U$1.4:SIGNAL2(4:SINGNAL_CH2)
SIGNAL3_INPUT: R63.1 U$1.1:SIGNAL3(1:SIGNAL_CH3)
ST_OUTPUT: BYPASS3.2 R14.2 T3.3(3:DRAIN) U$1.11:ST_SIGNAL(11:SIGNAL_ST)
TH_OUTPUT: BYASS4.2 R21.2 T4.3(3:DRAIN) U$1.15:TH_SINGNAL(15:SIGNAL_TH)
TX: IC2.8(TX) R45.2
VCC_RC1_5V: BYPASS2.1 C15.2 IC5.5(VOUT) R25.1
Unconnected: IC1.10(PD6(AIN0)) IC1.11(PD7(AIN1)) IC1.12(PB0(ICP)) IC1.19(ADC6) IC1.22(ADC7) IC1.23(PC0(ADC0)) IC1.24(PC1(ADC1)) IC1.25(PC2(ADC2)) IC2.26(CE1) IC2.27(ID_SD) IC2.28(ID_SC) IC3.9(Y2) IC3.10(B2) IC3.11(A2) IC3.12(Y3) IC3.13(B3) IC3.14(A3) IC4.8(LED2) IC4.9(LED3) IC4.10(LED4) IC4.11(LED5) IC4.12(LED6) IC4.13(LED7) IC4.15(LED8) IC4.16(LED9) IC4.17(LED10) IC4.18(LED11) IC4.19(LED12) IC4.20(LED13) IC4.21(LED14) IC4.22(LED15) S1.1 U$15.8(8:PGOOD)

## Notes on the sheet
- SWITCHED CAPACITOR DC/DC
- 注意　どちらか一方を実装のこと
- INPUT 1 | INPUT 2
- INPUT 3
- RC_AREA
- LDO 3V3
- RC_AREA
- 1N4148WS
- 1N4148WS
- SN74LVC1G17 | 1N4148WS
- SN74LVC1G17
- SN74LVC1G17
- RC CONTROL AREA
- SPI_LED
- RC CONTROL AREA
- Arduino
- 2SC2712
- Jetson Serial
- PWM Controller
- CRISTAL OSCILLATOR(OPTION)
- ICSP
- D11
- D12
- D13
- ＡＴＭＥＧＡ３２８Ｐ－ＡＵ
- option | Address 0x40
- 注意　実装しないこと | 注意　実装しないこと
- Serial
- RC_Car Connect
- Expansion channel
- IN
- *Signal from radio control receiver
- LP2985-5
- RC CONTROL AREA
- MULTIPLEXERS | steering | OUT
- *Signal to the car body
- throttle
- MC74HC157A
- T2N7002AK
- RC CONTROL AREA
- T2N7002AK
- Jetson Nano
- I2C(OLED)
- 2SC2712
- RC CONTROL AREA
- T2N7002AK
- T2N7002AK
- ATTENTION.
  ※　TT-01 or TT-02　USE　ONLY
- 2.0.24

## Library data of the parts
BYASS4 BYPASS1 BYPASS2 R1-R26 R28-R30 R32-R36 R43-R50 R55-R72 = FaBo-Resistors:RESISTOR: RESISTOR
BYPASS3 = FaBo-Resistors:RESISTOR: RESISTOR; SPICEPREFIX: R
C1-C8 C11-C18 C20 C21 = FaBo-Capacitor:CAPACITOR: CAPACITOR
C9 C10 C19 = FaBo-Capacitor:CAPACITOR: CAPACITOR; SPICEPREFIX: C
D2 = FaBo-Diode:CUS05F40
D4 D6 D7 = FaBo-Diode:DIODE
I2C = FaBo-Connetor:FABO-I2C
IC1 = component:ATMEGA328
IC2 = FaBo-Boards:JETSON_NANO
IC3 = FaBo-Multiplexers:MULTIPLEXERS
IC4 = FaBo-Motor:PCA9685
IC5 IC7 = FaBo-Supply:LP2985: LP2985
ICSP1 = component:ICSP_AVR
JETSON RC RC_POWER = FaBo-LED:LED
LED-SPI = FaBo-Connetor:FABO-SPI-LED
S1 = FaBo-Switch:SLIDE
T1 T2 = FaBo-Transistor:TRANSISTOR
T3 T4 T10 T11 = FaBo-Mosfet:T2N7002AK
TP1-TP7 = FaBo-Supply:TP
U3 U7 = FaBo_Photocoupler:TLP291A
U5 U$8 = FaBo_Photocoupler:TLP2270
U12 U21 U$6 U$10 = FaBo-Mosfet:SSM6N7002KFU
U20 U23 U$7 = FaBo-LogicIC:SN74LVC1G17
U$1 = FaBo-PIN:RC_17PIN_OUTIN
U$11 = FaBo-Crystal:KC2016Z
U$15 = FaBo-Supply:LTC3245
X2 = component:RESONATOR

## Board
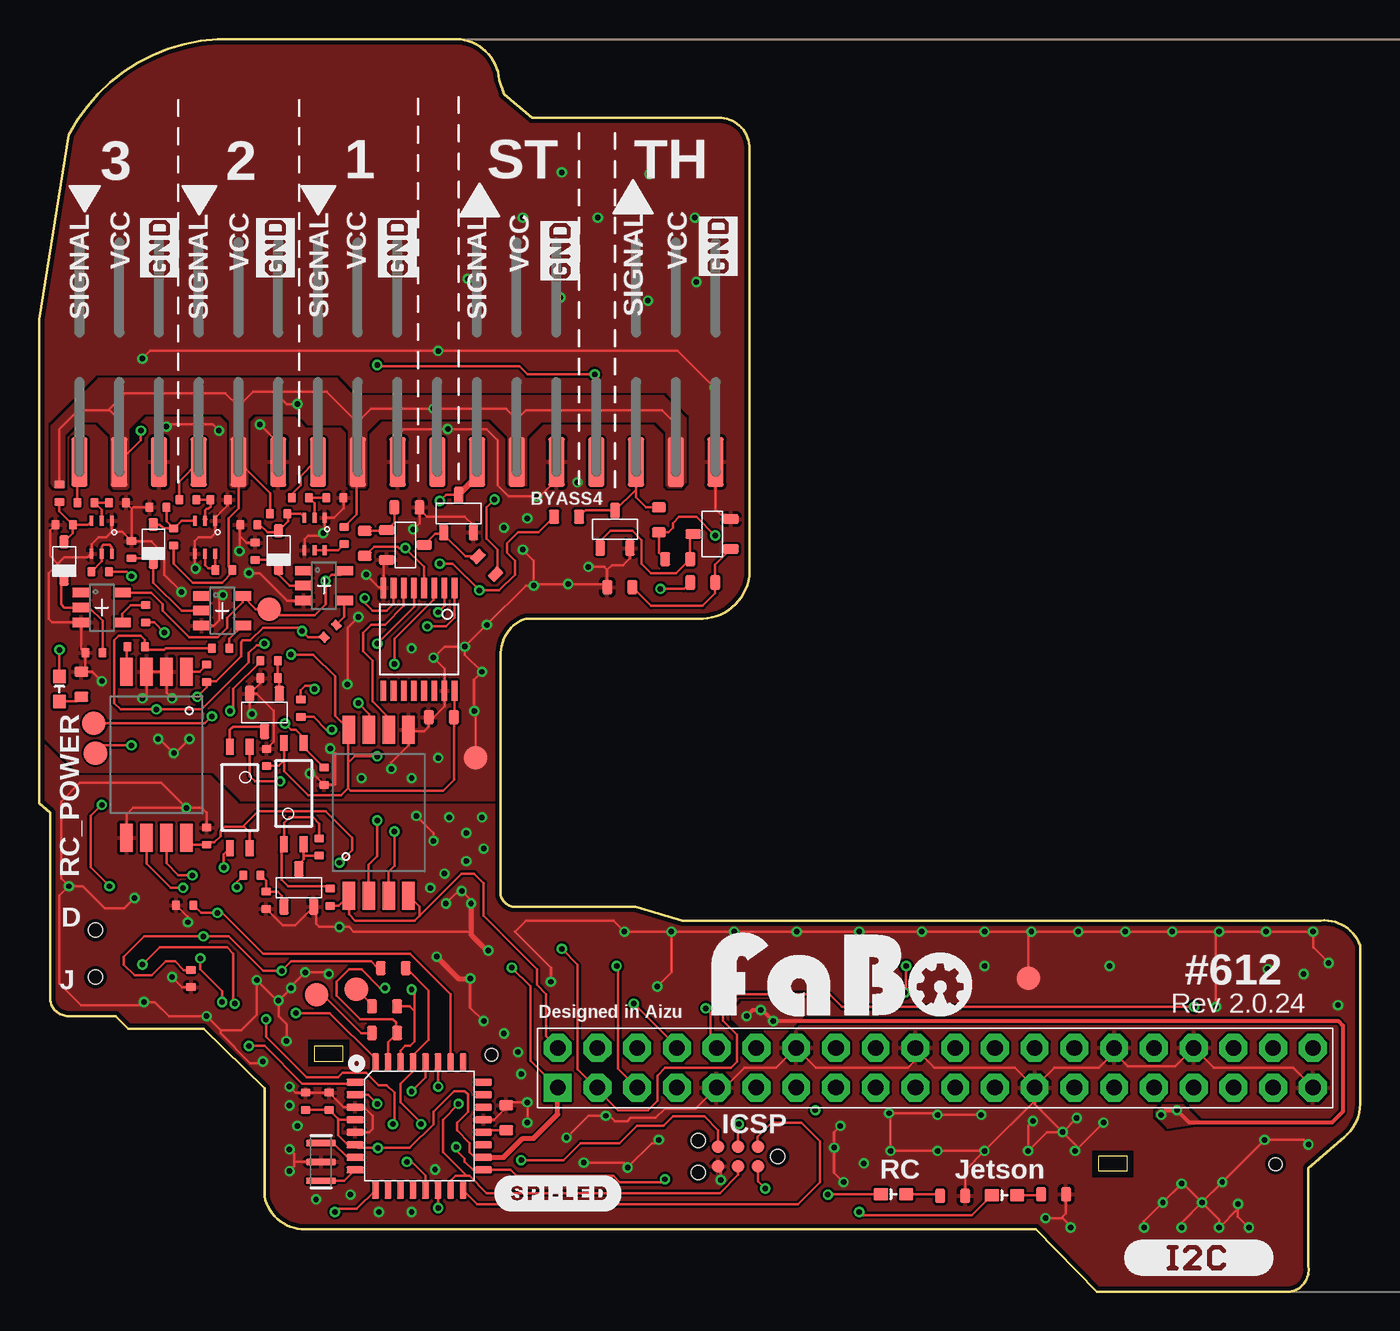
[diagram p8: board, top side]
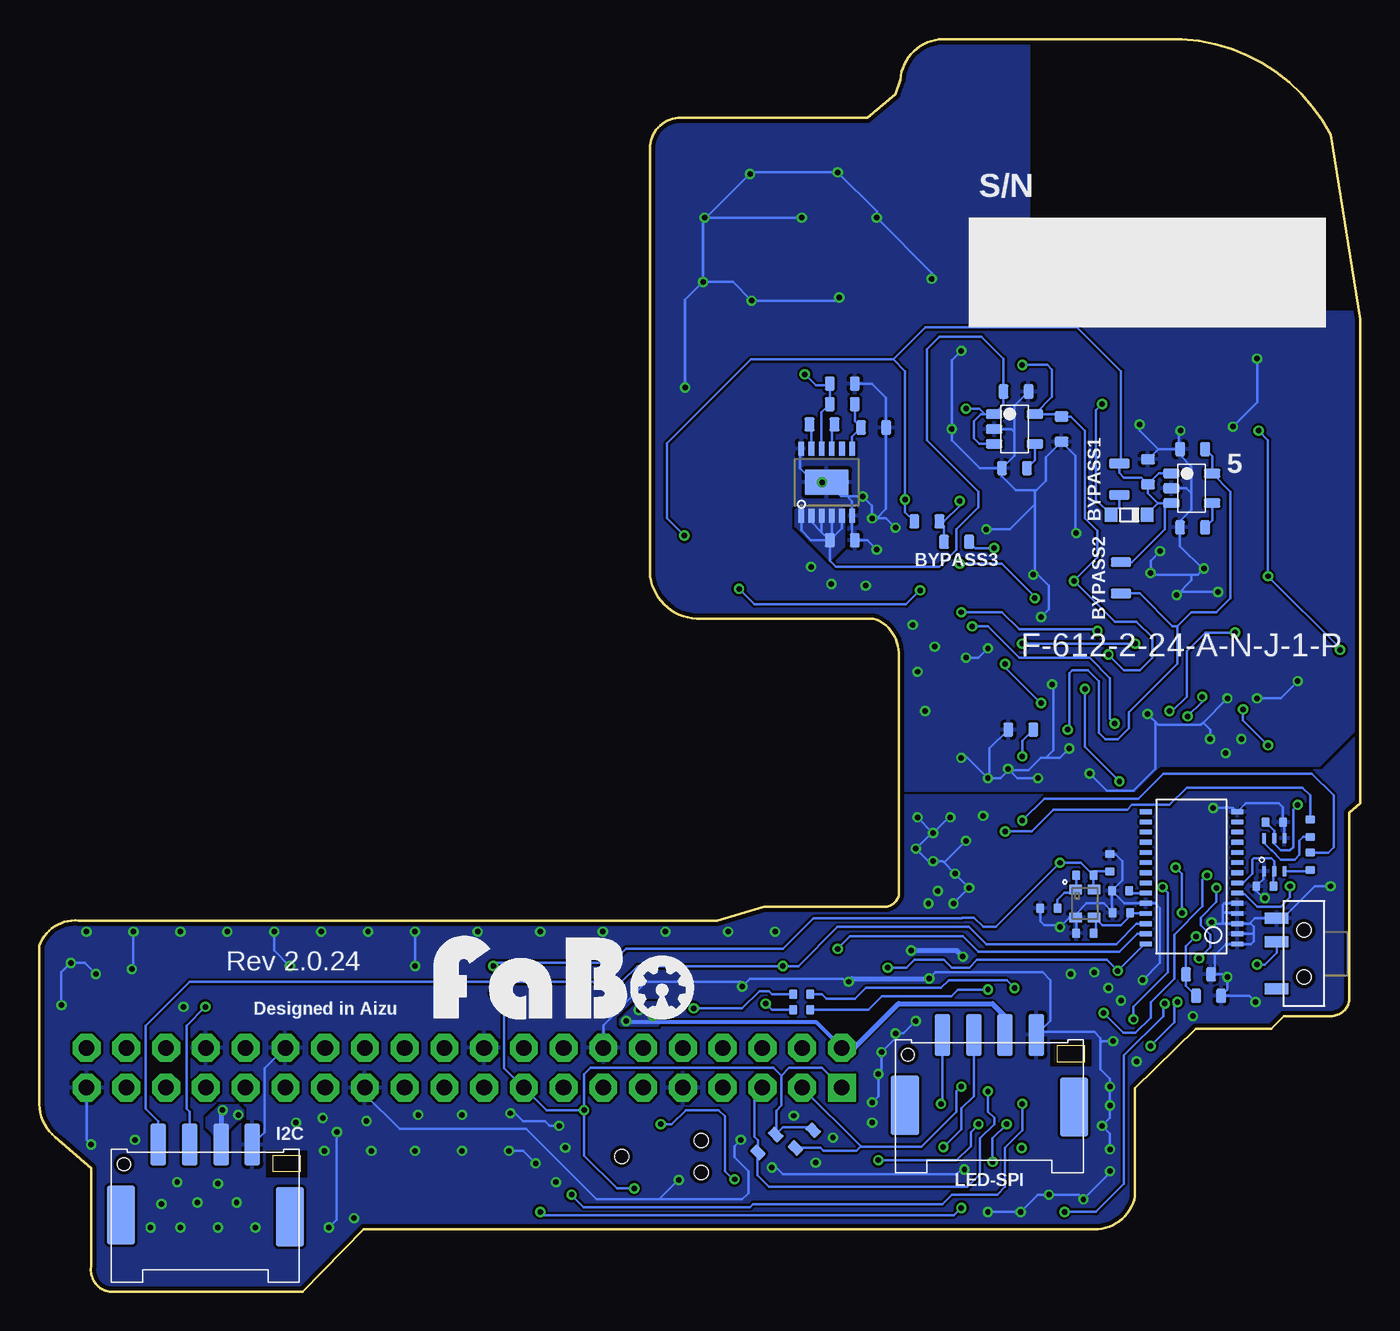
[diagram p9: board, bottom side, seen from below]

Size 84.42 x 80.01 mm. Coordinates in mm from the lower left corner, seen from the top.
Outline: 0,31.2 0,62.1 1.9,73.9 arc-60 11.4,80 26.4,80 arc-90 29.4,77.4 29.7,76.5 31.5,75 43.4,75 arc-90 45.4,73 45.4,46 arc-86 42.4,43 31.1,43 arc71 29.5,40.8 29.5,25.3 arc85 30.6,24.6 38.1,24.6 41.1,23.7 81.9,23.7 arc-78 84.4,22.1 84.4,12.5 arc-61 83.2,9.7 81.1,7.9 81.1,1.6 arc-90 79.9,0 67.6,0 63.7,4 17,4 arc-80 14.4,6.1 14.4,13 10.5,16.8 5.7,16.8 4.9,17.6 1.9,17.6 arc-85 0.7,18.7 0.7,30.6 0,31.2
Copper layers (1*16): Top 0.035mm / dielectric 1.6mm / Bottom 0.035mm
Design rules "PCBway": minimum track width 6mil, minimum drill 12mil, track to track 6mil, track to pad 6mil, pad to pad 6mil, via to via 6mil, smd to smd 6mil, copper to edge 10mil, drill to drill 10mil, minimum pad ring 10mil, minimum via ring 6mil, stop-mask expansion 2mil, vias tented up to drill 100mil, thermal gap 8mil
bKeepout: area 2.5,70.2 to 27,91.4
tRestrict: area 17.2,14.4 to 19.8,16.1; area 67.3,7.3 to 69.9,9
bRestrict: area -2.9,62.7 to 21.1,82.8; area 17.2,14.4 to 19.8,16.1; area 67.3,7.3 to 69.9,9

### Footprints (pad centres in the part's own frame; a part is rotated, then mirrored left to right if it is on the bottom)
0603 = smd 0.65 x 0.9: 1 -0.8,0; 2 0.8,0
0805 = smd 0.6 x 1.3: 1 -1,0; 2 1,0
0402 = smd 0.5 x 0.6: 1 -0.55,0; 2 0.55,0
CUS05F40 = smd 0.8 x 0.9: A -1.15,0; C 1.15,0
SOD-323 = smd 0.8 x 0.6: A -1.2,0; K 1.2,0
I2C-BM04B-PASS-1 = smd 1 x 2.7: 5V -1,0; GND -3,0; SCL 3,0; SDA 1,0 | smd 1.8 x 3.8: P$5 -5.4,4.6; P$6 5.4,4.5 | hole 0.8: 5.2,1.25
TQFP-32 = smd 1.1 x 0.45: 1 -4.1,2.8; 2 -4.1,2; 3 -4.1,1.2; 4 -4.1,0.4; 5 -4.1,-0.4; 6 -4.1,-1.2; 7 -4.1,-2; 8 -4.1,-2.8; 17 4.1,-2.8; 18 4.1,-2; 19 4.1,-1.2; 20 4.1,-0.4; 21 4.1,0.4; 22 4.1,1.2; 23 4.1,2; 24 4.1,2.8 | smd 0.45 x 1.1: 9 -2.8,-4.1; 10 -2,-4.1; 11 -1.2,-4.1; 12 -0.4,-4.1; 13 0.4,-4.1; 14 1.2,-4.1; 15 2,-4.1; 16 2.8,-4.1; 25 2.8,4.1; 26 2,4.1; 27 1.2,4.1; 28 0.4,4.1; 29 -0.4,4.1; 30 -1.2,4.1; 31 -2,4.1; 32 -2.8,4.1
JETSON_NANO_NOBOARDER = drill 1 pad 1.778 square: 1 1.27,1.27 | drill 1 pad 1.778 octagon: 2 1.27,3.81; 3 3.81,1.27; 4 3.81,3.81; 5 6.35,1.27; 6 6.35,3.81; 7 8.89,1.27; 8 8.89,3.81; 9 11.43,1.27; 10 11.43,3.81; 11 13.97,1.27; 12 13.97,3.81; 13 16.51,1.27; 14 16.51,3.81; 15 19.05,1.27; 16 19.05,3.81; 17 21.59,1.27; 18 21.59,3.81; 19 24.13,1.27; 20 24.13,3.81; 21 26.67,1.27; 22 26.67,3.81; 23 29.21,1.27; 24 29.21,3.81; 25 31.75,1.27; 26 31.75,3.81; 27 34.29,1.27; 28 34.29,3.81; 29 36.83,1.27; 30 36.83,3.81; 31 39.37,1.27; 32 39.37,3.81; 33 41.91,1.27; 34 41.91,3.81; 35 44.45,1.27; 36 44.45,3.81; 37 46.99,1.27; 38 46.99,3.81; 39 49.53,1.27; 40 49.53,3.81
TSSOP-16 = smd 0.36 x 1.3: 1 -2.275,-3.28; 2 -1.625,-3.28; 3 -0.975,-3.28; 4 -0.325,-3.28; 5 0.325,-3.28; 6 0.975,-3.28; 7 1.625,-3.28; 8 2.275,-3.28; 9 2.275,3.28; 10 1.625,3.28; 11 0.975,3.28; 12 0.325,3.28; 13 -0.325,3.28; 14 -0.975,3.28; 15 -1.625,3.28; 16 -2.275,3.28
PCA9685_BOTTOM = smd 0.3 x 0.75 bottom: 1 4.3,-2.93; 2 3.65,-2.93; 3 3,-2.93; 4 2.35,-2.93; 5 1.7,-2.93; 6 1.05,-2.93; 7 0.4,-2.93; 8 -0.25,-2.93; 9 -0.9,-2.93; 10 -1.55,-2.93; 11 -2.2,-2.93; 12 -2.85,-2.93; 13 -3.5,-2.93; 14 -4.15,-2.93; 15 -4.15,2.92; 16 -3.5,2.92; 17 -2.85,2.92; 18 -2.2,2.92; 19 -1.55,2.92; 20 -0.9,2.92; 21 -0.25,2.92; 22 0.4,2.92; 23 1.05,2.92; 24 1.7,2.92; 25 2.35,2.92; 26 3,2.92; 27 3.65,2.92; 28 4.3,2.92
SOT-23-5 = smd 0.6 x 1.05: 1 -0.95,-1.3; 2 0,-1.3; 3 0.95,-1.3; 4 0.95,1.3; 5 -0.95,1.3
TC2030 = smd 0.787 x 0.787: 1 1.27,-0.635; 2 1.27,0.635; 3 2.54,-0.635; 4 2.54,0.635; 5 3.81,-0.635; 6 3.81,0.635 | hole 0.889: 0,0; 5.08,-1.016; 5.08,1.016
0603' = smd 0.9 x 0.8: ANODE -0.8,0; CATHODE 0.8,0
SPI-BM04B-PASS-1 = smd 1 x 2.7: 5V -1,-0.1; CI 1,-0.1; DI 3,-0.1; GND -3,-0.1 | smd 1.8 x 3.8: P$5 -5.4,4.5; P$6 5.4,4.4 | hole 0.8: 5.2,1.15
SSSS810701 = smd 0.7 x 1.5: 1 -2.25,1.75; 2 0.75,1.75; 3 2.25,1.75 | hole 0.9: -1.5,0; 1.5,0
SOT-23 = smd 0.6 x 1: 1 -0.95,-1.2; 2 0.95,-1.2; 3 0,1.2
TP-15 = smd 1.5 x 1.5: 1 0,0
11-3C1 = smd 1 x 0.5: 1 -3.24,0.635; 2 -3.24,-0.635; 3 3.24,-0.635; 4 3.24,0.635
TLP2270 = smd 0.8 x 1.8: 1 -1.905,-5.3; 2 -0.635,-5.3; 3 0.635,-5.3; 4 1.905,-5.3; 5 1.905,5.3; 6 0.635,5.3; 7 -0.635,5.3; 8 -1.905,5.3
US6 = smd 0.3 x 0.635: 1 -0.65,-1.05; 2 0,-1.05; 3 0.65,-1.05; 4 0.65,1.05; 5 0,1.05; 6 -0.65,1.05
SOT-23' = smd 1.1 x 0.6: 1 -1.3,0.95; 2 -1.3,0; 3 -1.3,-0.95; 4 1.3,-0.95; 5 1.3,0.95
PNHEADER_2.54_SMT_17PIN_RC_TT01_02 = smd 1.02 x 3.17: 1:SIGNAL3 -20.32,0; 2:VCC3 -17.78,0; 3:GND3 -15.24,0; 4:SIGNAL2 -12.7,0; 5:VCC2 -10.16,0; 6:GND2 -7.62,0; 7:SIGNAL1 -5.08,0; 8:VCC1 -2.54,0; 9:GND1 0,0; 10:NC1 2.54,0; 11:ST_SIGNAL 5.08,0; 12:ST_VCC 7.62,0; 13:ST_GND 10.16,0; 14:NC2 12.7,0; 15:TH_SINGNAL 15.24,0; 16:TH_VCC 17.78,0; 17:TH_GND 20.32,0
KC2016Z = smd 0.6 x 0.8: #1 -0.9,-0.6; #2 0.9,-0.6; #3 0.9,0.6; #4 -0.9,0.6
MSOP12 = smd 0.42 x 0.889: 1 -1.625,-2.144; 2 -0.975,-2.144; 3 -0.325,-2.144; 4 0.325,-2.144; 5 0.975,-2.144; 6 1.625,-2.144; 7 1.625,2.144; 8 0.975,2.144; 9 0.325,2.144; 10 -0.325,2.144; 11 -0.975,2.144; 12 -1.625,2.144 | smd 2.845 x 1.651: 13 0,0
CSTNE_V_C = smd 0.4 x 1.9: 1 1.2,0; 2 0,0; 3 -1.2,0

### Placement (x,y rotation side)
BYASS4  33.7,49.5 0 top
BYPASS1  15.4,51.9 270 bottom
BYPASS2  15.3,45.6 90 bottom
BYPASS3  25.8,47.9 180 bottom
C1  29.84,11.12 270 top
C2  10.35,20.27 180 bottom
C3  18.52,12.17 270 top
C4  10.7,29.1 270 top
C5  9.7,20 90 top
C6  9.7,18.9 180 bottom
C7  16,27.4 90 bottom
C8  17.6,22.9 180 bottom
C9  21.7,35.9 0 bottom
C10  25.7,36.7 0 top
C11  19.1,55.1 90 bottom
C12  17.02,12.17 270 top
C13  22.1,52.6 0 bottom
C14  10.72,48.82 0 bottom
C15  10.72,53.83 0 bottom
C16  22,57.5 180 bottom
C17  33.1,48 180 bottom
C18  33.1,58 180 bottom
C19  14.53,34.12 270 top
C20  34.4,55.4 180 bottom
C21  13.57,52.37 270 bottom
D2  14.78,49.62 0 bottom
D4  15.3,47.4 270 top
D6  7.3,47.8 270 top
D7  1.6,46.7 270 top
I2C  73.8,9.4 180 bottom
IC1  24.29,10.59 0 top
IC2  31.86,11.77 0 top
IC3  24.27,41.67 180 top
IC4  10.79,26.51 270 top
IC5  10.78,51.32 270 bottom
IC7  22.1,55.1 270 bottom
ICSP1  47.2,8.63 180 top
JETSON  GREEN  [0603']  54.59,6.24 0 top
LED-SPI  23.7,16.3 180 bottom
R1  15.28,24.22 0 bottom
R2  22.62,20.67 180 top
R3  15.32,25.62 0 bottom
R4  3.2,29.6 270 bottom
R5  64.82,6.22 180 top
R6  3.2,27.5 270 bottom
R7  18.6,42.2 45 top
R8  11.6,41.1 0 top
R9  6.8,43.3 90 top
R10  58.37,6.12 180 top
R11  28.6,46.4 135 top
R12  22.07,18.23 0 top
R13  22.07,16.52 0 top
R14  27.7,49.2 0 bottom
R15  10.7,39.5 90 top
R16  6.2,41.2 180 top
R17  6.1,25.9 0 bottom
R18  20.8,47.8 90 top
R19  23.5,50.1 0 top
R20  40.8,46.8 0 top
R21  39.6,49.3 90 top
R22  37.92,9.47 45 bottom
R23  35.53,9.75 45 bottom
R24  9.3,24.7 180 top
R25  16.73,37.27 90 top
R26  5.5,30 180 bottom
R28  14.7,40.3 180 top
R29  18.23,32.92 90 top
R30  18.6,25.2 270 top
R32  14.7,39.2 180 top
R33  2.7,38.8 90 top
R34  17.9,28.4 90 top
R35  13.6,26.6 180 top
R36  14.5,25 90 top
R43  17.6,26.6 0 bottom
R44  19.9,24.5 0 bottom
R45  35.7,18 180 bottom
R46  35.7,19 180 bottom
R47  42.4,45.3 0 top
R48  37.1,45 180 top
R49  33.1,56.7 180 bottom
R50  31.1,55.2 180 bottom
R55  19.5,48.3 90 top
R56  15.3,49.7 180 top
R57  11.8,46.1 0 top
R58  8.6,48.2 270 top
R59  3.9,46 0 top
R60  1.3,51 90 top
R61  16.7,50.7 0 top
R62  9.5,50.6 0 top
R63  3,50.4 0 top
R64  13.8,47.3 270 top
R65  5.9,47.4 270 top
R66  3.5,40.8 0 top
R67  5,50.4 180 top
R68  11.5,50.6 180 top
R69  18.9,50.7 180 top
R70  13.4,49 0 top
R71  7.6,50.1 0 top
R72  1.6,49 0 top
RC  RED  [0603']  61.68,6.17 0 top
RC_POWER  ORANGE  [0603']  1.3,38.5 270 top
S1  3.6,21.6 90 bottom
T1  14.4,37 180 top
T2  16.6,25.8 0 top
T3  26.8,49.7 0 top
T4  36.8,48.7 0 top
T10  23.4,47.7 270 top
T11  43,48.4 90 top
TP1  20.27,19.32 90 top
TP2  17.73,18.98 0 top
TP3  63.21,20.02 0 top
TP4  14.7,43.6 0 top
TP5  3.5,36.3 0 top
TP6  3.6,34.4 0 top
TP7  27.9,34.1 0 top
U3  12.82,31.57 270 top
U5  7.5,34.3 180 top
U7  16.27,31.82 90 top
U12  10.6,48.2 180 top
U20  SN74LVC1G17  [SOT-23']  11.7,43.5 0 top
U21  4,48.2 180 top
U23  SN74LVC1G17  [SOT-23']  4,43.7 0 top
U$1  22.9,53 0 top
U$2  [LOGO_FABO_L]  50.6,17.6 0 top
U$3  [LOGO_FABO_L]  51.6,17.4 0 bottom
U$5  [LOGO_SILK_GND]  16.35,64.77 90 top
U$6  5.5,27.9 0 bottom
U$7  SN74LVC1G17  [SOT-23']  18.2,45.1 0 top
U$8  21.7,30.6 0 top
U$9  [LOGO_SILK_GND]  24.15,64.77 90 top
U$10  17.6,48.4 180 top
U$11  17.6,24.8 270 bottom
U$12  [LOGO_SILK_GND]  34.55,64.57 90 top
U$13  [LOGO_SILK_GND]  44.65,64.87 90 top
U$14  [LOGO_SILK_I2C]  74.1,1 0 top
U$15  34.1,51.7 0 bottom
U$19  [LOGO_SILK_GND]  8.95,64.77 90 top
X2  18.01,8.29 90 top

### Tracks (layer width: path | path; a pad name or v marks a point on that pad's centre or on a via)
0  (via drill 0.35)
  Top 0.152: v11.5,55 11.1,55.4 8.3,55.4 v8.15,55.25 7.66,54.76 U$1.3:GND3 | U$1.6:GND2 15.28,54.22 v14.1,55.4 | v6.6,59.6 7.1,60.1 v25.5,60.1 40.8,60.1 v43.15,57.75 43.22,57.68 U$1.17:TH_GND 43.22,49.99 43.57,49.64 43.91,49.64 T11.2 | 33.06,51.86 U$1.13:ST_GND | v6.6,37.9 6.87,38.16 U5.3 U5.2 8.13,38.27 v8.5,37.9 | v4,39 3.4,39.6 R33.2 2.95,39.85 R66.1 2.7,41.05 U23.3 0.85,42.75 0.6,43 0.6,45.9 1.2,46.5 | T1.2 14.15,38.9 R32.2 | U$8.5 23.6,35.8 | v18.6,34.7 18.9,34.4 18.9,32.4 18.87,32.37 R29.1 17.5,33.1 v17.3,33.1 | C19.1 15,35.15 15,37.1 13.9,38.2 T1.2 | v22.5,33.4 22.5,33.8 23.6,34.9 23.6,35.8 | v13.6,36.9 13.45,37.05 T1.2 | U$1.9:GND1 23.1,53.2 23.1,54.9 23.3,55.1 v26.1,55.1 28.6,55.1 29.3,54.4 29.3,51.5 30,50.8 v31.8,50.8 32,50.8 33.06,51.86 | 33.06,51.86 33.46,52.26 | v7.6,35.3 7.7,35.3 v8.6,34.4 8.7,34.4 v9.6,35.3 | 23.6,35.8 24.6,35.8 24.9,36.1 C10.1 25.2,36.7 25.9,37.4 IC3.15 25.9,39.8 v25.2,40.5 25.9,41.2 v27.2,41.2 | v10,46.2 9.95,46.25 U12.4 9.95,47.95 10.2,48.2 11,48.2 11.25,48.45 U12.1 11.25,49.45 12.05,50.25 R68.1 | U20.3 11.15,42.55 11.5,42.9 11.5,44.27 v11.73,44.5 | v13.4,45.9 14.1,45.9 15.85,44.15 U$7.3 | v9.1,44.7 8,45.8 8,47.1 7.15,47.95 R65.1 | 1.2,46.5 1.6,46.9 3.1,46.9 U21.4 3.35,47.75 3.8,48.2 4.3,48.2 4.65,48.55 | 1.2,46.5 0.7,47 0.7,48.65 R72.1 | R64.1 13.25,47.85 12.8,48.3 | U$10.4 16.95,48.05 17.2,48.3 18,48.3 v18.15,48.45 18.25,48.55 U$10.1 18.85,49.45 19.45,50.05 R69.1 | R65.1 5.9,50 | R71.1 6,50.1 5.9,50 | 4.65,48.55 U21.1 | R65.1 5.3,48.55 4.65,48.55 | 12.8,48.3 12.8,48.95 R70.1 | 12.8,48.3 v12.8,47.3 | R67.1 5.55,50.35 5.9,50 | v23.9,48.7 24.3,49.1 24.3,50
  Top 0.152: 24.3,50 R19.2 | T3.2 27.75,48.95 27.2,49.5 24.8,49.5 24.3,50 | v20.9,45.8 21.7,45 22,45 IC3.8 22,46.55 T10.2 | v20.4,43.1 19.7,42.4 v19.7,38.8 | 36.3,46.1 R48.2 36.1,45.2 v33.8,45.2 31.7,45.2 v31.6,45.1 | v31.6,45.1 31.1,45.1 v28.6,42.6 v27.2,41.2 | 36.3,46.1 36.6,46.4 37.3,46.4 37.75,46.85 T4.2 | 36.3,46.1 36.1,46.3 v35.1,46.3 | v31.6,45.1 31.6,46.7 v30.9,47.4 | TP7.1 27.9,37 v27.8,37.1 27.8,39.1 v28.3,39.6 27.2,40.7 v27.2,41.2
  Bottom 0.152: C21.1 12.92,53.83 | 12.92,53.83 11.6,53.83 | 11.6,53.83 C15.1 11.52,53.42 10.8,52.7 10.8,51 | v11.5,55 11.6,54.9 11.6,53.83 | v14.1,55.4 14.1,55.01 12.92,53.83 | v27.4,64.7 27.4,65.1 v30.9,68.6 30.9,69 v33.4,71.5 38.9,71.5 v39,71.4 41.8,68.6 v41.9,68.6 | v41.9,68.6 v35.7,68.6 | v41.9,68.6 42,68.5 v42,64.5 | v33.3,63.5 33.5,63.3 v38.9,63.3 40.1,64.5 v42,64.5 | v42,64.5 43.15,63.35 v43.15,57.75 | v6.6,37.9 5.1,37.9 v4,39 | 22.5,33.3 21.2,33.3 20.4,34.1 20.1,34.1 | 20.1,34.1 19.2,34.1 v18.6,34.7 | v8.5,37.9 10.05,36.35 | 10.05,36.35 10.2,36.2 12.9,36.2 v13.6,36.9 13.1,36.4 13.1,33.4 14.49,32.01 16.2,32.01 v17.3,33.1 | v6.6,59.6 6.6,56.8 v8.15,55.25 | v9.6,35.3 9.6,35.9 10.05,36.35 | 23.7,32.8 v23.8,32.8 25.1,34.1 v25.5,34.1 | 23.7,32.8 23,32.8 22.5,33.3 | 22.5,33.3 v22.5,33.4 21.9,32.8 v20.6,32.8 | v19.7,38.8 19.6,38.7 19.6,34.6 20.1,34.1 | v25.5,60.1 26.1,59.5 v26.1,55.1 26.1,54.4 24.3,52.6 C13.1 | v25.2,40.5 24.4,40.5 v23.8,41.1 | C9.1 23.7,34.7 23.7,32.8 | 22.1,54.9 22.1,53.4 C13.1 | 22.1,54.9 22.1,56.6 C16.1 | 20.7,51.2 20.1,51.8 20.1,53.3 C11.1 18.2,53.4 18.2,48.5 v18.15,48.45 | 20.7,51.2 22,51.2 22.9,52.1 C13.1 | 10.05,46.15 10.4,45.8 10.8,45.8 | 10.05,46.15 v10,46.2 | 10.8,45.8 13.3,45.8 v13.4,45.9 13.4,46.7 v12.8,47.3 | 10.8,45.8 10.8,45.43 v11.73,44.5 11.53,44.7 v9.1,44.7 | IC7.2 22.3,55.1 22.1,54.9 | 10.05,46.15 11.53,47.62 C14.1 11.53,49.22 10.8,49.95 10.8,51 | 20.7,51.2 20.8,51.1 20.8,50.3 | 20.8,50.3 22.4,48.7 v23.9,48.7 | 20.8,50.3 20.8,45.9 | 20.8,45.9 v20.9,45.8 | v20.4,43.1 19.9,43.6 19.9,45.1 20.7,45.9 20.8,45.9 | U$15.13 33.7,51.7 32.48,50.48 U$15.6 32.48,48.17 C17.1 31.5,48 v30.9,47.4
  Bottom 0.152: U$15.12 35.8,53.77 35.8,52.6 34.9,51.7 v34.4,51.7 U$15.13 | C18.1 31.2,58 30.3,57.1 R50.1 30.3,50 30.9,49.4 | U$15.13 33.2,50.8 v31.8,50.8 31.2,50.2 v31.2,49.4 30.9,49.4 | v29.7,48.8 30.3,49.4 30.9,49.4 | 10.8,51 11.12,51.32 IC5.2
  pour Top (rank 2): -2.5,38.2 -2.5,77.8 3,83.3 41.3,83.3 51.4,73.2 51.4,46.4 36.4,31.4 12.9,31.4 11.1,33.2 2.5,33.2
  pour Bottom (rank 2): -4.3,40.5 -4.3,79.7 1.6,85.6 43.7,85.6 53.6,75.7 53.6,44 41.6,32 14.4,32 12.9,33.5 12.9,33.6 2.6,33.6
3V3  (via drill 0.35)
  Top 0.152: v46.4,6.6 45.93,7.07 ICSP1.2 | IC2.1 31.4,14.77 31.4,19.5 v30.2,20.7 | C12.2 C3.2 19.1,11.04 19.1,10.9 | IC1.18 27.82,8.59 27.5,8.9 27.5,9.5 26.7,10.3 26.7,10.8 27.4,11.5 27.4,12.6 27.2,12.8 26.5,12.8 25.2,11.5 25.2,10.7 23.68,9.19 v21.64,9.19 20.39,9.19 IC1.6 19.72,9.38 19.1,10.01 19.1,10.9 | v55.3,19.1 55.4,19.2 v55.4,20.8 | R2.2 21.63,20.67 21.2,21.1 16.1,21.1 v15.5,20.5 14.3,20.5 12.1,22.7 v10.5,22.7 6.7,22.7 5.4,21.4 5.4,20.9 6.1,20.2 7.2,20.2 8.1,21.1 8.7,21.1 9.25,20.55 C5.2 | v19.2,27.4 20,28.2 20,29 18.3,30.7 14,30.7 13,29.7 | U5.8 9.86,28.55 C4.2 10.85,28.7 11.2,28.7 11.6,29.1 11.6,29.4 11.9,29.7 13,29.7 | U3.4 13.46,29.34 13.1,29.7 13,29.7 | IC1.4 19.18,10.98 19.1,10.9
  Top 0.305: IC1.18 29.68,8.59 30.9,9.8 31.6,9.8 33.13,11.33 IC2.1
  Bottom 0.152: 37,13.8 37,11.9 37.32,11.58 37.32,10.12 37.3,10.1 | 37,13.8 36.5,14.3 34.4,14.3 IC2.1 | 37,13.8 37.5,14.3 49.2,14.3 49.6,13.9 v49.6,11.6 | v49.6,11.6 49.6,8.7 47.5,6.6 v46.4,6.6 | IC4.28 13.79,22.21 v15.5,20.5 16.2,21.2 24.5,21.2 25,20.7 26.11,20.7 26.6,21.2 28.5,21.2 29,20.7 v30.2,20.7 | R43.2 17.05,25.75 U$11.#4 | C7.1 17.05,26.85 R43.2 | v55.4,20.8 55.2,21 47.83,21 46.93,21.91 36.9,21.91 34.96,23.84 25.47,23.84 25.41,23.9 24.7,23.9 24.1,23.3 23.3,23.3 v19.2,27.4 17.85,27.4 R43.2 | v55.3,19.1 54.7,18.5 54.7,14.29 IC2.17 52.02,11.6 v49.6,11.6 | R23.2 35.15,10.5 36.9,10.5 37.3,10.1 | 37.3,10.1 R22.2 | v10.5,22.7 11.14,22.05 C2.2 11.14,19.55 C6.2
5V  (via drill 0.35)
  Top 0.152: 24.3,24 27,26.7 27.8,26.7 28.4,26.1 28.4,24 31.8,20.6 31.8,19.6 32.4,19 32.4,16.3 IC2.2 | 24.3,24 24,23.7 20.2,23.7 19.8,24.11 U$8.1 19.14,24.65 R30.2 | U$8.4 24.3,24.61 24.3,24
  Top 0.254: v71.7,11.3 72,11.6 v72.7,11.6 73.5,10.8 82.6,10.8 83.3,11.5 83.3,17 83,17.3 v46.9,17.3 46.2,18 v46.1,18 45.6,18 v45.2,17.6
  Bottom 0.152: 22.7,17.6 LED-SPI.5V
  Bottom 0.254: IC2.2 34.76,17.2 46.8,17.2 v46.9,17.3
  Bottom 0.305: IC2.2 32.33,15.57 29.5,18.4 23.5,18.4 22.7,17.6 | I2C.5V 72.8,11.5 v72.7,11.6
  pour Bottom (no thermals): 72.6,10.1 71.7,11 71.6,11 71.4,11.2 71.4,11.6 71.7,11.9 72.9,11.9 73.7,11.1 73.7,10.5 73.3,10.1
  pour Top (no thermals): 72.13,10.47 71.4,11.2 71.4,11.5 71.8,11.9 73.1,11.9 74.22,10.78
  pour Bottom (no thermals): 44.9,17 44.4,17.5 44.4,18 44.9,18.5 45.7,18.5 46.2,18.5 47.3,17.4 47.3,17.1 47.2,17
  pour Top: 44.3,17.4 44.3,17.9 44.9,18.5 47.2,18.5 47.3,18.4 48.1,18.4 48.7,17.8 48.7,17.5 48.1,16.9 44.8,16.9
AVR_MISO
  Top 0.152: IC1.16 27.98,5.6 48.5,5.6 49.9,7 49.9,9.6 48.7,10.8 46.8,10.8 45.9,9.9 45.9,9.3 ICSP1.1
AVR_MOSI  (via drill 0.35)
  Top 0.152: ICSP1.4 44.66,7.46 43.5,6.3 28.6,6.3 27.5,7.4 27.3,7.4 | 27.3,7.4 26.6,7.4 26.29,7.09 IC1.15 | v26.8,12 25.8,11 25.8,8.9 27.3,7.4
  Bottom 0.152: LED-SPI.DI 26.7,12.1 v26.8,12
AVR_RESET  (via drill 0.35)
  Top 0.152: ICSP1.5 43.39,10.31 42.5,11.2 40.5,11.2 39.9,10.6 38.2,10.6 37.1,9.5 34.6,9.5 33.5,8.4 v30.8,8.4 | v24.4,10.7 24.4,10.8 23.1,12.1 23.1,13.3 23.89,14.09 IC1.29 23.89,15.09 24.9,16.1 24.9,19.24 23.47,20.67 R2.1
  Bottom 0.152: v30.8,8.4 25.8,8.4 24.9,9.3 24.9,10.2 v24.4,10.7
AVR_RX  (via drill 0.35)
  Top 0.152: IC1.30 23.09,15.39 23.4,15.7 23.7,15.7 24,16 24,17.9 | R12.2 23.68,18.23 24,17.9 | 24,17.9 24,19.1 v23.8,19.3
  Bottom 0.152: v23.8,19.3 25.7,19.3 26.12,18.88 30.56,18.88 31.44,18 R45.1
AVR_SCK  (via drill 0.35)
  Top 0.152: ICSP1.3 44.66,10.66 v44.7,10.7 | v26.64,9.24 26.64,9.04 27.2,8.49 27.2,8.3 27.71,7.79 IC1.17 30.11,7.79 30.5,7.4 36.7,7.4 37.1,7 39.8,7 v39.98,7.18
  Bottom 0.152: v44.7,10.7 44,10.7 43.1,11.6 41,11.6 40.6,11.2 40.6,7.7 40.09,7.18 v39.98,7.18 | v26.64,9.24 25.5,10.39 25.5,11.37 25.5,11.71 24.7,12.5 LED-SPI.CI
AVR_TX  (via drill 0.35)
  Top 0.152: IC1.31 22.29,15.95 R13.2 22.8,16.59 22.8,17.2 22.6,17.4 20.5,17.4 19,18.9 19,19.8 19.8,20.6 20.6,20.6 21.8,19.4 v22.1,19.4
  Bottom 0.152: v22.1,19.4 22.59,19.89 26.3,19.89 26.8,19.41 31.59,19.41 32.3,18.7 34.1,18.7 34.4,19 R46.1
D3  (via drill 0.35)
  Top 0.152: RC.ANODE 59.62,4.9 52.6,4.9 v52.4,5.1 | IC1.14 v25.49,5.37 v25.5,5.36
  Bottom 0.152: v52.4,5.1 52.2,4.9 25.96,4.9 v25.5,5.36
D4  (via drill 0.35)
  Top 0.152: JETSON.ANODE 50.44,6.24 v50.4,6.2 | v21.6,12 21.02,12.59 IC1.2
  Bottom 0.152: v21.6,12 21.6,10.3 22.7,9.2 22.7,6.7 23.2,6.2 26.1,6.2 26.7,5.6 38.8,5.6 39,5.4 49.63,5.4 50.4,6.17 v50.4,6.2
GND  (via drill 0.35)
  Top 0.152: IC1.21 29.06,10.98 29.84,11.77 C1.1 30.02,12.1 v31.2,12.1 v31.2,10.8 | ICSP1.6 43.56,7.83 v43.56,7.14 | 16.3,8.29 X2.2 | IC1.5 21.09,10.19 21.3,10.4 21.3,11.23 20.8,11.74 20.24,11.74 IC1.3 19.46,11.79 C3.1 C12.1 16.38,12.72 v16,13.1 | v28.4,17.3 27.55,18.15 v27.55,20 | 55.99,15.5 55.99,14.79 55.5,14.3 49.65,14.3 IC2.14 47.09,14.3 45.05,14.3 43.79,13.04 IC2.9 41.95,11.7 40,11.7 39.4,11.1 37.8,11.1 37.6,10.9 36.8,10.9 36.46,11.24 v36.2,11.24 35.1,11.24 v33.7,9.84 | 55.99,15.5 IC2.20 | IC2.25 62.34,14.3 57.19,14.3 55.99,15.5 | IC2.25 64.88,14.3 67.7,14.3 68.69,15.29 | 68.69,15.29 IC2.30 | 68.69,15.29 69.58,14.4 72.59,14.4 IC2.34 75.05,14.3 80.12,14.3 IC2.39 | v32.7,19.8 32.7,20.7 30.4,23 31.1,23.7 36.7,23.7 v37.4,23 v40.4,23 | v60.4,9 v57.4,9 v54.4,9 54.4,11.3 v54.3,11.4 57.3,11.4 v57.4,11.3 v60.2,11.3 | v60.4,9 63.61,12.21 | 63.61,12.21 IC2.25 | v82.4,21 81.4,22 v81.4,23 v78.4,23 75.5,23 | 75.5,23 v75.4,23 v72.4,23 v69.4,23 v66.4,23 v63.4,23 | v63.4,23 v60.4,23 v56.4,23 v52.4,23 | v52.4,23 v48.4,23 v44.4,23 v40.4,23 | v40.4,23 40.4,20.4 v39.5,19.5 | v37.6,7.94 37.63,7.97 | 37.63,7.97 39.16,9.5 39.6,9.5 v39.6,9.7 | v16,7.7 16.3,8 16.3,8.29 | v16,9.1 16.3,8.8 16.3,8.29 | TP3.1 63.21,22.81 v63.4,23 | v1.9,25.9 1.3,25.3 1.3,19.7 2.7,18.3 6.5,18.3 v6.7,18.5 7.4,18.5 8.3,17.6 v10.7,17.6 11.6,16.7 | v66.2,9 66.25,9.05 | 66.25,9.05 v68,10.8 | v65.4,10.2 63.61,11.99 63.61,12.21 | v65.4,10.2 66.25,9.35 66.25,9.05 | v81.1,9.4 80.8,9.7 v78.3,9.7 v75.6,7 v74.3,5.7 | v34.8,8.24 37.36,8.24 37.63,7.97 | v52.7,18.9 52.7,22.7 v52.4,23 | v75.2,18.2 75.2,22.7 75.5,23 | 28.6,21.8 v28.7,21.8 | v26,24.8 26.8,25.6 v27,25.6 27.6,25 v27.6,24.8
  Top 0.152: v8.5,20.1 9.15,19.45 C5.1 | R10.1 59.17,7.77 v60.4,9 | v65.9,4.1 65.9,4.2 65.4,4.7 65.3,4.7 | v74.3,5.7 75.4,4.6 v75.4,4.1 76.6,5.3 v76.6,5.6 76.6,4.8 v77.3,4.1 | v73,4.1 73,4.4 v74.3,5.7 | v74.3,5.7 73.1,6.9 v73,6.9 v71.8,5.7 70.6,4.5 v70.6,4.1 | C4.1 10.7,30.6 10.4,30.9 v9.4,30.9 | v9.4,30.9 6,30.9 5.59,30.5 U5.5 | 27.6,23 20.1,23 19.8,23.3 v19.2,23.3 17.9,23.3 17.7,23.5 17.7,24.45 T2.2 16.35,23.4 15.55,23.4 R36.1 | 11.6,16.7 12.9,16.7 13.9,17.7 v13.9,19.9 15.2,18.6 v15.3,18.6 | v6.1,25.16 5.44,24.5 4.2,24.5 2.8,25.9 v1.9,25.9 | R24.2 9.5,23.95 v9.5,23.6 | v9.4,30.9 7.8,32.5 2.6,32.5 1.4,31.3 1.4,26.4 v1.9,25.9 | v24.1,30.4 25.2,29.3 v25.2,28.8 | 11.6,16.7 11.6,16.5 13.5,14.6 14.2,14.6 v14.3,14.7 | v15.8,16 15.8,17.1 15.3,17.6 v15.3,18.6 | v15.3,18.6 v16.1,19.4 16.1,19.5 v17,20.4 18.4,20.4 v18.5,20.3 | v51.4,7 50.8,7.6 v50.8,9.2 50.8,10.2 v51.2,10.6 | v63.5,10.9 63.2,10.6 v63.2,9 64.4,10.2 v65.4,10.2 | v66.3,11.1 v65.4,10.2 | v64.3,4.7 65.3,4.7 | R5.1 65.62,5.02 65.3,4.7
  Top 0.305: 28.6,21.8 27.6,22.8 27.6,23 v27.6,24.8 | v25.4,21.4 26.8,20 v27.55,20
  Bottom 0.152: v43.56,7.14 44.8,5.9 | 44.8,5.9 48.8,5.9 53.3,10.4 61.4,10.4 63.61,12.61 IC2.25 | IC2.14 48.37,17.03 45.6,19.8 39.6,19.8 39.6,19.5 v39.5,19.5 39,20 33.1,20 32.8,19.7 | v27.55,20 27.15,20.4 20.3,20.4 19.8,19.9 19.8,17.3 LED-SPI.GND 20.5,16.6 17,16.6 16.6,16.2 16.6,15.9 | IC4.4 7.91,24.2 8.8,24.2 | 8.71,23.51 IC4.3 7.1,23.51 | 8.71,23.51 8.8,23.6 8.8,24.2 | IC4.2 6.94,22.86 6.8,23 | 6.8,23 6.8,23.3 7.01,23.51 7.1,23.51 | 6.8,23 6.8,22.4 7,22.2 7.01,22.21 IC4.1 8.59,22.21 9.3,21.5 9.3,20.27 | C2.1 9.3,20.27 | 9.3,20.27 8.66,20.27 v8.5,20.1 8.5,19.3 C6.1 7.1,18.9 v6.7,18.5 | v25.3,7.8 25.5,7.8 25.8,7.5 36.9,7.5 37.34,7.94 v37.6,7.94 | IC2.30 70,14.27 70,10.2 I2C.GND | 44.8,5.9 39.5,5.9 39.1,6.3 39.1,7.7 40,8.6 40,9.3 v39.6,9.7 | v51.2,10.6 51.8,10.6 52.1,10.9 53.5,10.9 54,11.4 v54.3,11.4 | v52.7,8.2 53.5,9 v54.4,9 | 7.1,23.51 6.76,23.85 S1.3 4.95,23.85 2.9,25.9 v1.9,25.9 | v16,7.7 16,7.6 v17.7,5.9 18,6.2 v19.9,6.2 20.6,6.2 v21.7,5.1 v23.8,5.1 | v16,9.1 16,10.1 v16.5,10.6 16,11.1 v16,11.9 v16,13.1 16,13.6 16.6,14.2 16.6,15.9 | IC2.39 81.39,9.69 v81.1,9.4 | v65.4,10.2 65.4,4.6 v65.9,4.1 | v83,18.3 83,20.4 v82.4,21 81.5,21 v80.8,20.3 | R3.1 15.06,24.81 IC4.24 13.1,24.8 12.8,24.5 12.8,21 v13.9,19.9 | R3.1 15.88,24.27 R1.1 16.41,24.8 17.5,24.8 18.15,24.15 18.15,23.85 | U$6.1 6.2,26.8 6.2,26.35 R17.1 6.65,25.61 6.15,25.11 v6.1,25.16 | 18.15,23.85 C8.2 | 18.15,23.85 U$11.#2 18.6,23.9 v19.2,23.3 19.3,23.4 20.2,23.4 20.45,23.65 R44.1 | IC4.5 8.69,24.81 8.8,24.7 8.8,24.2 | R3.1 15.2,26.3 15.2,27.5 15.65,27.95 C7.2 | v9.4,30.9 8.11,30.9 IC4.14 7.33,31.2 5.2,31.2 4.95,30.95 R26.1 4.85,29.9 U$6.4
  Bottom 0.152: v9.5,23.6 9.41,23.51 8.71,23.51 | 26.65,27.45 v25.9,26.7 v25,25.8 v26,24.8 | 26.65,27.45 26.7,27.5 v27.3,27.5 27.6,27.5 v28.4,28.3 27.4,29.3 v27.3,29.3 | v25.2,28.8 26.55,27.45 26.65,27.45 | v31.2,12.1 30.8,12.5 v30.8,13.9 30.6,14.1 v30.6,15.3 29.7,16.2 v29.7,16.5 29.2,16.5 v28.4,17.3 | v78.5,20.6 78.4,20.7 v78.4,23 | v68.4,20.8 69.4,21.8 v69.4,23 | v60.4,20.8 v60.4,23 | v15.8,16 16.5,16 16.6,15.9 | v26.2,30.3 26.3,30.3 v27.3,29.3 | v27.3,29.3 v28.3,30.3
  Bottom 0.305: v28.7,21.8 25.8,21.8 v25.4,21.4 | v27.55,20 32.5,20 v32.7,19.8 32.8,19.7
  pour Top (rank 3): -4.82,100.72 123.22,100.72 123.22,-10.88 -4.82,-10.88
  pour Bottom (rank 3): -7.58,100.17 125.07,100.17 125.07,-0.07 -7.58,-0.07
M
  Bottom 0.152: U$15.11 35.08,55.27 C20.2
N$2
  Bottom 0.152: R17.2 5.55,26.8 U$6.2 5.5,27.5 5.7,27.7 6.8,27.7 6.9,27.6 6.9,26.7 7.49,26.11 IC4.7
N$4
  Top 0.152: IC1.20 28.52,10.31 C1.2
N$5
  Top 0.152: IC1.8 19.5,7.09 X2.3
N$6
  Top 0.152: R12.1 21.27,18.32 TP1.1
N$7
  Bottom 0.152: R3.2 14.62,25.46 IC4.23
N$8
  Bottom 0.152: U$11.#3 16.9,23.8 | 16.9,23.8 16.5,23.4 15.3,23.4 14.72,23.98 14.72,24.2 | 14.72,24.2 R1.2 | C8.1 16.9,23.05 16.9,23.8 | IC4.25 14.69,24.16 14.72,24.2
N$9
  Top 0.152: U5.4 5.59,41.15 R16.2
N$10
  Top 0.152: R15.2 10.25,39.6 U5.1
N$11  (via drill 0.35)
  Top 0.152: R28.2 14.15,40.25 12.4,38.5 12.4,37.3 v12.2,37.1 | R9.1 7.35,42.75 v8,42.1
  Bottom 0.152: v8,42.1 9.9,42.1 11.1,40.9 11.1,38 12,37.1 v12.2,37.1
N$12
  Top 0.152: R7.2 19.5,43.1 U$7.4
N$13  (via drill 0.35)
  Top 0.152: v4.5,25.9 3.3,27.1 3.3,30.4 v4,31.1
  Bottom 0.152: R26.2 5.5,29.45 U$6.5 5.5,28.6 5.1,28.2 4.5,28.2 4.3,28.4 4.3,30.8 v4,31.1 | 7.91,25.5 IC4.6 7.8,25.4 7.4,25.4 6.6,24.6 5.1,24.6 4.5,25.2 v4.5,25.9
N$14
  Top 0.152: U$8.6 22.34,36.66 21.3,37.7 21.3,40.3 20.7,40.9 20.7,42.1 21.2,42.6 22.1,42.6 23.3,43.8 IC3.6
N$15
  Top 0.152: IC1.7 19.71,8.59 18.8,9.5 18.8,9.4 18.1,9.4 X2.1
N$16  (via drill 0.35)
  Top 0.152: IC1.9 20.29,5.29 19.09,5.29 v18.9,5.1 | v12.5,18.4 12.4,18.5 12.4,21.6 12,22 7.7,22 v6.6,20.9
  Bottom 0.152: v18.9,5.1 16.9,5.1 15.1,6.9 15.1,15.1 12.6,17.6 12.6,18.3 v12.5,18.4 | S1.2 5.35,21.65 6.1,20.9 v6.6,20.9
N$17
  Top 0.152: R13.1 20.58,16.52 18.13,18.98 TP2.1
N$18
  Top 0.152: R11.2 27.23,46.97 25.85,48.35 25.85,48.4 | 25.85,48.4 T3.1 | T10.3 25.3,48.4 25.85,48.4
N$19
  Top 0.152: RC.CATHODE 63.96,6.17 R5.2
N$20
  Top 0.152: JETSON.CATHODE 57.46,6.24 R10.2
N$21
  Bottom 0.152: U$6.6 6.15,28.66 5.7,28.2 5.67,28.2 5.07,27.6 4.2,27.6 3.9,27.9 3.9,28.8 3.65,29.05 R4.2
N$22
  Bottom 0.152: R6.2 3.3,26.85 U$6.3
N$23  (via drill 0.35)
  Top 0.152: v21.6,30.1 21.6,27.8 21.07,27.27 U$8.2
  Bottom 0.152: R6.1 2.05,28.05 1.7,28.4 1.7,31.7 3.1,33.1 12.6,33.1 14.2,31.5 20.2,31.5 v21.6,30.1
N$24  (via drill 0.35)
  Top 0.152: v22.7,29.4 22.7,27.2 22.34,26.84 U$8.3
  Bottom 0.152: R4.1 3.2,31.7 3.7,32.2 11.1,32.2 12.2,31.1 14.6,31.1 14.9,30.8 19.6,30.8 21,29.4 v22.7,29.4
N$25  (via drill 0.35)
  Top 0.152: U3.1 13.46,33.6 13.46,32.94 13.8,32.6 v15.4,32.6 | v17.6,38.5 17.4,38.7 17,38.7 16.73,38.42 R25.2
  Bottom 0.152: v15.4,32.6 17.6,34.8 v17.6,38.5
N$26
  Top 0.152: T1.3 14.1,36.1 12.4,36.1 12.19,35.89 U3.2
N$27
  Top 0.152: T1.1 15.35,39.1 R32.1 R28.1
N$28
  Top 0.152: R33.1 2.4,37.7 RC_POWER.CATHODE
N$29
  Top 0.152: T2.1 15.5,24.75 15.5,25.3 15.25,25.55 R36.2 14.5,26.25 R35.1
N$30
  Top 0.152: T2.3 16.6,27.3 16.91,27.61 16.91,27.9 | 16.91,27.9 U7.2 | R34.1 16.96,27.85 16.91,27.9
N$31
  Bottom 0.152: IC5.4 9.47,49.27 C14.2
N$33
  Top 0.152: R34.2 17.9,29.9 17.5,30.3 16,30.3 15.64,29.94 U7.1 15.5,28.44 15.5,26.3 15.9,25.9 18.45,25.9 R30.1
N$34
  Top 0.152: T11.1 43.2,46.45 R47.2 43.2,44.6 42.4,43.8 39.1,43.8 R48.1
N$35
  Top 0.152: R18.2 22.15,48.6 T10.1 22.7,49.15 R19.1
N$36
  Top 0.152: T11.3 41.6,48.2 R20.2 40.7,45.9 39.1,45.9 38.5,46.5 38.5,48 37.9,48.6 36.5,48.6 35.85,47.95 T4.1
N$37  (via drill 0.35)
  Top 0.152: v20.4,37.6 21.1,36.9 21.1,35.94 U$8.7 | IC3.3 25.21,44.91 25.21,44.2 22.7,41.7 v22.7,40.1
  Bottom 0.152: v22.7,40.1 22.7,39.9 v20.4,37.6
N$39
  Bottom 0.152: R49.1 32.3,55.6 R50.2 32.48,54.62 U$15.7
N$49
  Bottom 0.152: R43.1 18.15,25.75 U$11.#1 18.4,25.5 18.9,25.5 19.35,25.05 R44.2
N$54
  Top 0.152: R56.1 15.9,49.7 | 15.9,49.7 16.7,49.7 U$10.3 | 15.9,49.7 15.9,49.2 D4.A 15.2,48.5 14.6,48.5 14.1,49 R70.2
N$55
  Top 0.152: R64.2 14.75,46.75 D4.K 15.3,45.8 16,45.1 U$7.2
N$57
  Top 0.152: R58.1 9.1,49.25 U12.3 | R58.1 7.95,48.75 7.7,49 D6.A | R58.1 8.15,49.2 R71.2
N$58
  Top 0.152: U20.2 9.1,43.5 7.3,45.3 D6.K 7.05,46.85 R65.2
N$59
  Top 0.152: R8.2 12.15,41.7 U20.4
N$60
  Top 0.152: D7.A 2.15,48.45 R72.2 | R72.2 3.1,49 U21.3 | R72.2 1.3,49.85 R60.1
N$62
  Top 0.152: R66.2 4.05,42.85 3.2,43.7 U23.2 1.6,43.7 1.4,43.9 1.4,45.3 D7.K
N$63
  Top 0.152: R9.2 5.85,43.85 5.3,43.3 U23.4
N$64
  Top 0.152: R69.2 R61.2 17.6,50.35 U$10.2
N$68
  Top 0.152: U21.2 4,49.95 R63.2 R67.2
N$69
  Bottom 0.152: C13.2 20.8,53.1 IC7.4
N$72
  Top 0.152: U$10.5 U$10.6 19.1,47.35 R55.1
N$73
  Top 0.152: U12.2 10.5,49.35 | U12.2 10.7,49.35 | U12.2 10.6,49.9 10.7,50 10.8,50 10.95,50.15 10.95,50.5 | 10.95,50.5 R68.2 | R62.2 10.85,50.6 10.95,50.5
N$74
  Top 0.152: R57.1 11.25,46.2 | 11.25,46.2 U12.6 | U12.5 10.6,46.4 10.8,46.2 11.25,46.2
N$75
  Top 0.152: R59.1 4,46.65 U21.5 4,47.6 4.1,47.7 4.5,47.7 4.65,47.55 U21.6
P
  Bottom 0.152: C20.1 33.77,55.23 U$15.9
PCH1  (via drill 0.35)
  Top 0.152: TP5.1 10.59,36.3 v11.04,36.76 | v10.1,38 10.7,38.6 R15.1 10.75,39 11.3,39 12.9,40.6 12.9,41.5 13,41.6 13.5,41.6 14.3,42.4 16.6,42.4 v16.8,42.2 17.19,41.81 R7.1 | IC3.2 25.9,43.8 v25.5,43.4
  Bottom 0.152: v11.04,36.76 10.1,37.7 v10.1,38 | v16.8,42.2 16.9,42.3 21.8,42.3 22.9,43.4 v25.5,43.4
PCH2  (via drill 0.35)
  Top 0.152: v14.39,41.4 14.3,41.3 13.9,41.3 13.4,40.8 13.4,40.2 10.4,37.2 v7.5,37.2 5.2,37.2 4.8,37.6 4.8,41.6 5.1,41.9 6.5,41.9 6.75,41.65 R16.1 6.95,41 8,41 8.1,41.1 R8.1 | TP6.1 4.1,34.9 v5.9,34.9 | v21.61,41.4 23.95,43.74 IC3.5
  Bottom 0.152: v5.9,34.9 7.5,36.5 v7.5,37.2 | v14.39,41.4 v21.61,41.4
PCH3  (via drill 0.35)
  Top 0.152: IC1.26 26.29,19.01 23.7,21.6 14.3,21.6 11.7,24.2 v11.4,24.2 10.35,24.2 R24.1 | v11.8,27.1 11.8,27.94 U3.3
  Bottom 0.152: v11.4,24.2 11.4,26.7 v11.8,27.1
PCH6  (via drill 0.35)
  Top 0.152: R29.2 16.91,34.78 U7.3 16.91,35.39 16.4,35.9 16.1,35.9 v15.7,36.3 | v24.8,42.5 26,42.5 26.55,43.05 IC3.1
  Bottom 0.152: v15.7,36.3 16,36.6 16,39.2 17.3,40.5 21.8,40.5 23.8,42.5 v24.8,42.5
PCH_1  (via drill 0.35)
  Top 0.152: R35.2 12.64,26.19 v12.64,25.84 | v14.5,17.4 14.5,16.3 17.1,13.7 19.1,13.7 19.4,14 20.9,14 21.7,13.2 22.2,13.2 22.7,12.7 22.7,10.8 v22.6,10.7 | v23.5,8.3 23.8,8.3 24.69,7.41 IC1.13
  Bottom 0.152: v12.64,25.84 12.3,25.5 12.3,20.4 14.5,18.2 v14.5,17.4 | v22.6,10.7 23.5,9.8 v23.5,8.3
PH1-328  (via drill 0.35)
  Top 0.152: U5.7 8.13,27.36 8.9,26.6 v9.8,26.6 | v16.4,17.8 18.57,17.8 21.49,14.88 IC1.32
  Bottom 0.152: v9.8,26.6 10.1,26.3 10.1,24.61 11.9,22.81 11.9,20 13.4,18.5 13.4,17.51 14.37,16.54 15.14,16.54 v16.4,17.8
PH2_328  (via drill 0.35)
  Top 0.152: U5.6 6.87,27.34 8.4,25.8 v9.2,25.8 | IC1.1 20.09,13.29 16.82,13.29 14.4,15.7 v13.4,15.7 | v11.69,18.5 11.69,19.21 10.3,20.6 v10.3,21.3
  Bottom 0.152: v13.4,15.7 11.9,17.2 11.9,18.29 v11.69,18.5 | v10.3,21.3 9.6,22 9.6,22.8 10.2,23.4 10.2,23.9 9.2,24.9 v9.2,25.8
RC_+B_3V3  (via drill 0.35)
  Top 0.152: U$7.5 19.25,45.8 18.7,45.8 v18.3,45.4 18.3,43.9 17.6,43.2 15.1,43.2 TP4.1 13.85,43.6 U20.5 13,44.05 12,43.05 12,42.4 11.4,41.8 9.6,41.8 7.9,43.5 7.9,43.9 7.15,44.65 U23.5 | v16.1,40.7 17.5,40.7 18.9,39.3 18.9,36.8 19.75,35.95 | 19.75,35.95 U$8.8 | C19.2 14.55,33.6 15.3,33.6 15.64,33.94 | U7.4 15.64,33.94 | 15.64,33.94 15.64,33.26 17.2,31.7 19.3,31.7 19.75,32.15 | 19.75,32.15 19.75,33.8 | 19.75,33.8 19.75,35.95 | v21.6,34.2 20.15,34.2 19.75,33.8 | v21.6,59.2 21.7,59.1 30.7,59.1 31.2,58.6 v35.5,58.6 | 19.75,32.15 19.89,32 25.8,32 26.5,32.7 C10.2 26.55,36.75 IC3.16
  Bottom 0.152: v16.1,40.7 15.1,39.7 14.1,39.7 13.3,40.5 13.3,41.8 14.3,42.8 15.7,42.8 v18.3,45.4 16.8,46.9 16.8,48.6 17.6,49.4 17.6,55 18.5,55.9 C11.2 19.25,56.05 IC7.5 19.7,57.15 19.7,58.9 20,59.2 v21.6,59.2 | C9.2 21.6,35.2 v21.6,34.2 | U$15.10 34.42,56.17 R49.2 33.9,57.9 | 33.9,57.9 C18.2 | v35.5,58.6 34.8,57.9 33.9,57.9
RC_B_VCC  (via drill 0.35)
  Top 0.152: U$1.16:TH_VCC 40.68,55.42 39.8,56.3 31.1,56.3 30.52,55.72 | 30.52,55.72 29.84,56.4 v25.2,56.4 21.2,56.4 20.38,55.58 20.28,55.58 | 20.28,55.58 18.36,57.5 15,57.5 | v16.5,56.7 15.8,56.7 15,57.5 | R58.2 8.6,46.5 9.8,45.3 11.7,45.3 12.35,45.95 R57.2 12.1,46.35 12.1,49.4 12.74,50.04 U$1.5:VCC2 | R60.2 1.3,55.1 2.5,56.3 4.4,56.3 | 4.4,56.3 4.5,56.3 5.12,55.68 U$1.2:VCC3 6.5,54.38 v6.5,55 | 4.4,56.3 5.5,57.4 11.9,57.4 12.74,56.56 | U$1.5:VCC2 12.74,56.56 | 12.74,56.56 13.68,57.5 15,57.5 | 20.28,55.58 20.28,53.08 U$1.8:VCC1 20.3,52.94 20.3,49.65 R55.2 | U$1.12:ST_VCC 30.52,55.72 | R59.2 5.6,46 v5.9,45.7 | v1.3,41 RC_POWER.ANODE | U$1.5:VCC2 14.75,50.99 R56.2
  Bottom 0.152: v16.5,56.7 16.9,56.3 16.9,50.59 D2.A 15.4,50.15 BYPASS1.2 | IC7.3 24.35,54.15 24.7,54.5 24.7,55.6 24.25,56.05 24,56.05 | 24,56.05 IC7.1 22.8,56.65 C16.2 22.8,59.6 24.2,61 26.9,61 27.7,60.2 27.7,54.4 24.4,51.1 24.4,50.1 25.8,48.7 25.8,47.4 26.9,46.3 33.5,46.3 33.9,46.7 C17.2 | C17.2 33.77,48.12 33.77,48.3 | 33.77,48.3 U$15.4 | U$15.5 33.12,48.77 33.6,48.3 33.77,48.3 | U$15.3 34.42,48.52 | 34.42,48.52 C17.2 | U$15.2 35.08,49.17 34.42,48.52 | U$15.1 35.73,48.62 35.1,48 C17.2 | v6.5,55 5.9,54.4 v5.9,45.7 1.3,41.1 v1.3,41 | 24,56.05 24.35,56.4 v25.2,56.4
  pour Bottom (no thermals): 33,48.4 33,49.9 33.1,50 33.2,50.1 35.9,50.1 36.1,49.9 36.1,49.8 36.1,48.9 35.2,48 33.9,46.7 33,47.6
  pour Top (no thermals): 0.8,55.3 0.8,51.6 1,51.4 1.6,51.4 1.6,54.7 2.5,55.6 3.7,55.6 4.6,54.7 4.6,51.5 4.8,51.3 5.6,51.3 5.7,51.4 5.7,55.1 6.7,56.1 11.7,56.1 12.2,55.6 12.2,51.5 12.3,51.4 13.1,51.4 13.3,51.6 13.3,51.7 13.3,55.7 13.7,56.1 16.5,56.1 17.1,55.5 17.2,55.4 19.4,55.4 19.8,55 19.8,51.6 20,51.4 20.8,51.4 20.9,51.5 20.9,51.6 20.9,54.9 21.8,55.8 22,55.8 28.8,55.8 30,54.6 30,51.6 30.1,51.5 31.1,51.5 31.1,54.6 32.1,55.6 39.4,55.6 40.1,54.9 40.1,51.5 40.2,51.4 41,51.4 41.3,51.7 41.3,51.8 41.3,55.8 39.9,57.2 20.1,57.2 19,58.3 3.8,58.3
RC_VCC2  (via drill 0.35)
  Top 0.152: R20.1 39.6,47.2 R21.1 40.2,48.5 40.5,48.8 40.5,49.1 40.9,49.5 42,49.5 v43.2,48.3 | R11.1 29.3,45.97 29.3,47.4 28.6,48.1 28.6,50.1 v29.1,50.6
  Bottom 0.152: C21.2 12.88,52.27 IC5.1 | 29.85,59.55 27.8,61.6 18.1,61.6 15.3,58.8 15.3,53 BYPASS1.1 15.4,52.3 15.1,52 14.01,52 C21.2 | C21.2 13.7,51.57 13.6,51.47 | 29.85,59.55 38.95,59.55 44.3,54.2 44.3,49.4 v43.2,48.3 | R14.1 29.1,49.8 v29.1,50.6 29.1,58.8 29.85,59.55 | BYPASS2.2 14.6,46.6 12.5,48.7 12.5,50.07 12.2,50.37 IC5.3 12.93,50.37 | 12.93,50.37 13.65,49.65 D2.C | C21.2 13.57,51.02 12.93,50.37
RCH1  (via drill 0.35)
  Top 0.152: R18.1 21.4,47.6 22.9,47.6 23,47.5 v23.4,47.5 24.6,46.3 IC3.4
  Bottom 0.152: BYPASS3.1 24.6,47.5 v23.4,47.5
RCH2  (via drill 0.35)
  Top 0.152: v25.6,46.5 26.43,46.5 v28.13,44.8 29.4,44.8 30.4,45.8 30.4,46.7 29.9,47.2 29.9,47.8 30.6,48.5 31.9,48.5 BYASS4.1 | R47.1 41.2,44.9 v39.7,44.9 | v20.8,44.3 20.8,44 21.3,43.5 22.2,43.5 22.65,43.95 IC3.7
  Bottom 0.152: v28.13,44.8 29.03,43.9 38.7,43.9 v39.7,44.9 | v20.8,44.3 20.75,44.35 22.9,46.5 v25.6,46.5
RX  (via drill 0.35)
  Top 0.152: IC2.10 42.89,15.97 42.89,17.81 v42.6,18.1
  Bottom 0.152: v42.6,18.1 39.5,18.1 38.41,19.2 37.8,19.2 37.6,19 R46.2
SCL  (via drill 0.35)
  Top 0.152: v23.8,12.8 24.69,13.69 IC1.28 | IC2.5 37,14.24 37,20.7 v36.9,20.8
  Bottom 0.152: IC2.5 38.21,12.72 38.7,12.23 38.7,9.9 38.49,9.69 R22.1 38.53,8.87 38.53,7.43 37.8,6.7 25.1,6.7 24.3,7.5 24.3,9.8 23.4,10.7 23.4,11.1 23.8,11.5 v23.8,12.8 | IC4.26 13.72,23.5 14.3,23.5 15.6,22.2 23.9,22.2 25,23.3 33.4,23.3 35.9,20.8 v36.9,20.8 46.2,20.8 47.2,19.8 74.8,19.8 77.6,17 77.6,11.7 76.8,10.9 I2C.SCL
SDA  (via drill 0.35)
  Top 0.152: v25.5,13.1 v25.49,13.11 IC1.27 | v33.4,21.9 34.4,20.9 34.4,14.2 35.56,13.04 35.6,13.04 | 35.6,13.04 IC2.3 | 35.6,13.04 35.6,13 37,11.6 38.9,11.6 39.5,12.2 39.5,13.8 40,14.3 44.2,14.3 44.6,14.7 44.6,16.4 43.7,17.3 43.7,18.6 44.1,19 50.5,19 51.3,18.2 v73.8,18.2
  Bottom 0.152: v25.5,13.1 25.8,12.8 25.8,11.5 28.05,9.25 31.89,9.25 31.92,9.28 | v33.4,21.9 32.6,22.7 25.4,22.7 24.4,21.7 15.4,21.7 14.24,22.86 IC4.27 | v73.8,18.2 75,17 75,11.7 74.8,11.5 I2C.SDA | R23.1 36.09,9.13 36.03,9.2 34.5,9.2 34.3,9 32.2,9 31.92,9.28 | IC2.3 31.92,9.28
SIGNAL1_INPUT
  Top 0.152: R61.1 16.15,50.95 16.7,51.5 16.7,52.1 17.6,53 U$1.7:SIGNAL1
SIGNAL2_INPUT
  Top 0.152: R62.1 8.95,51.75 U$1.4:SIGNAL2
SIGNAL3_INPUT
  Top 0.152: R63.1 2.45,52.87 U$1.1:SIGNAL3
ST_OUTPUT  (via drill 0.35)
  Top 0.152: v25.6,50.5 26,50.9 T3.3 | 27.98,52.2 U$1.11:ST_SIGNAL
  Top 0.406: T3.3 27.98,52.08 27.98,52.2
  Bottom 0.152: v25.6,50.5 25.6,50.2 26.6,49.2 R14.2 26.6,48.9 BYPASS3.2
TH_OUTPUT
  Top 0.152: U$1.15:TH_SINGNAL 38.14,51.24 | 38.14,51.24 38.14,50.74 38.78,50.1 R21.2 | 38.14,51.24 T4.3 34.9,49.9 BYASS4.2
TX  (via drill 0.35)
  Top 0.152: v38,18.4 40.75,15.65 IC2.8
  Bottom 0.152: v38,18.4 37.6,18 R45.2
VCC_RC1_5V  (via drill 0.35)
  Top 0.152: v18.7,35.9 18.35,35.9 17.53,36.72 R25.1
  Bottom 0.152: C15.2 9.47,53.38 IC5.5 8.3,51.09 8.3,44.3 9.2,43.4 10.8,43.4 11.7,42.5 | 11.7,42.5 11.7,40.1 14.8,37 14.8,36 15.5,35.3 16.3,35.3 16.7,35.7 16.7,39 17.4,39.7 18.4,39.7 18.6,39.5 18.6,36 v18.7,35.9 | BYPASS2.1 14.1,44.6 12,42.5 11.7,42.5

### Text on the board
tPlace: 3 | 2 | 1 | ST | TH | VCC | VCC | VCC | VCC | VCC | SIGNAL | SIGNAL | SIGNAL | SIGNAL | SIGNAL | RC_POWER | D | #612 | J | Designed in Aizu | Rev 2.0.24 | ICSP | RC | Jetson
bPlace: S/N | 5 | F-612-2-24-A-N-J-1-P | Rev 2.0.24 | Designed in Aizu
Document: Note: Implement one or the other / See circuit diagram for details | 2N7002K | 2N7002K | 2N7002K | 2N7002K | MC74HC157A | TLP2270 | TLP2270 | AVR 328P | #612 JetRacer Rev 2.0.24 / 2022/11/14,2022/11/17 / 2022/12/14
tDocu: 1N4148WS | 1N4148WS | 1N4148WS | 2SC2712 | 2SC2712
bDocu: LP2985-33 | LP2985-50